# EAGLE schematic Esp_DVK (EAGLE 6.6.0)

## Sheet 1 of 9
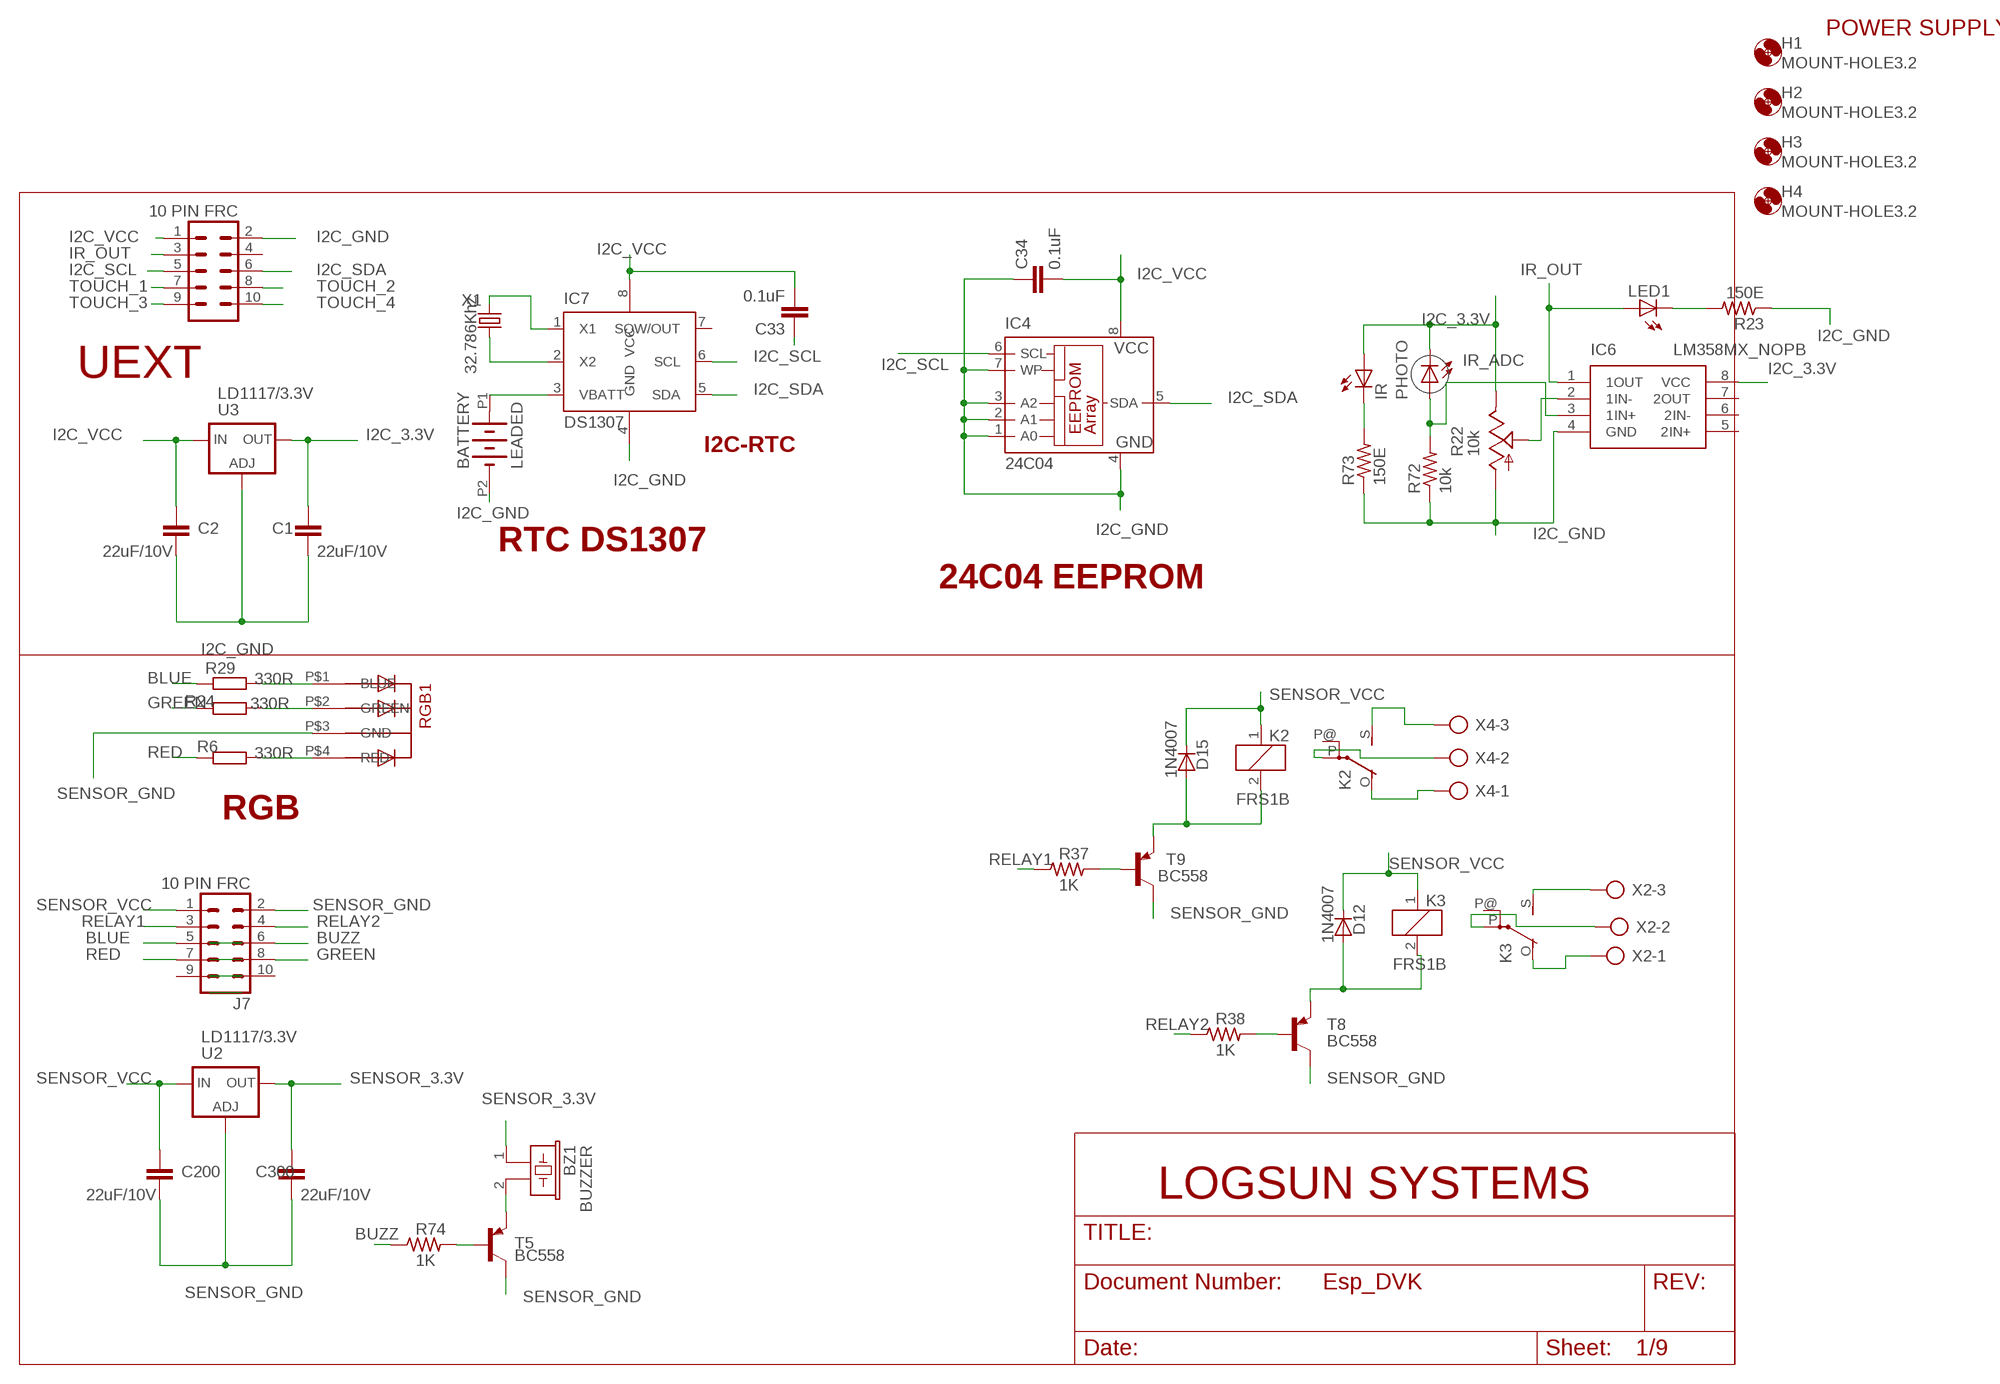
[diagram p0: schematic, sheet 1]

### Parts
BATTERY  LEADED  [LEADED]
BZ1  BUZZER  BUZZ  [BUZZ]
C1  22uF/10V  C-EUC1206  [C1206]
C2  22uF/10V  C-EUC1206  [C1206]
C33  0.1uF  C-EUC1206  [C1206]
C34  0.1uF  C-EUC1206  [C1206]
C200  22uF/10V  C-EUC1206  [C1206]
C300  22uF/10V  C-EUC1206  [C1206]
D12  1N4007  1N4004DIODE  [MLL34]
D15  1N4007  1N4004DIODE  [MLL34]
H1  MOUNT-HOLE3.2  [3,2]
H2  MOUNT-HOLE3.2  [3,2]
H3  MOUNT-HOLE3.2  [3,2]
H4  MOUNT-HOLE3.2  [3,2]
IC4  24C04  24C04ASM  [SO-08M]
IC6  LM358MX_NOPB  [SOIC127P600X175-8N]
IC7  DS1307  [SO08]
IR  LED5MM  [LED5MM]
J3  10 PIN FRC  ML10  [ML10]
J7  10 PIN FRC  ML10  [ML10]
K2  FRS1B  [FRS1B]
K3  FRS1B  [FRS1B]
LED1  LEDCHIPLED_1206  [CHIPLED_1206]
PHOTO  LED5MM  [LED5MM]
R6  330R  R-EU_R1206  [R1206]
R22  10k  TRIM_US-RJ9W  [RJ9W]
R23  150E  R-US_R1206  [R1206]
R24  330R  R-EU_R1206  [R1206]
R29  330R  R-EU_R1206  [R1206]
R37  1K  R-US_R1206  [R1206@1]
R38  1K  R-US_R1206  [R1206@1]
R72  10k  R-US_R1206  [R1206]
R73  150E  R-US_R1206  [R1206]
R74  1K  R-US_R1206  [R1206@1]
RGB1  5MMRGBLED  [LED5MMRGB]
T5  BC558  -PNP-SOT23-EBC  [SOT23-EBC]
T8  BC558  -PNP-SOT23-EBC  [SOT23-EBC]
T9  BC558  -PNP-SOT23-EBC  [SOT23-EBC]
U2  LD1117/3.3V  LD117AS12TR  [SOT223]
U3  LD1117/3.3V  LD117AS12TR  [SOT223]
X1  32.786Khz  CRYSTALTC38H  [TC38H]
X2  AK300/3  [AK300/3]
X4  AK300/3  [AK300/3]

### Nets
BLUE: J7.5 R29.1
BUZZ: J7.6 R74.1
GREEN: J7.8 R24.1
I2C_3.3V: C1.2 IC6.8(VCC) IR.A PHOTO.K(C) R22.E U3.4(OUT)
I2C_GND: BATTERY.P2(-) C1.1 C2.1 C33.1 C34.1 IC4.1(A0) IC4.2(A1) IC4.3(A2) IC4.4(GND) IC4.7(WP) IC6.4(GND) IC7.4(GND) J3.2 R22.A R23.1 R72.1 R73.1 U3.1(ADJ)
I2C_SCL: IC4.6(SCL) IC7.6(SCL) J3.5
I2C_SDA: IC4.5(SDA) IC7.5(SDA) J3.6
I2C_VCC: C2.2 C33.2 C34.2 IC4.8(VCC) IC7.8(VCC) J3.1 U3.3(IN)
IR_ADC: IC6.3(1IN+) PHOTO.A R72.2
IR_OUT: IC6.1(1OUT) J3.3 LED1.A
N$1: R24.2 RGB1.P$2(GREEN)
N$6: IC6.2(1IN-) R22.S
N$7: K3.S(2:S) X2.3
N$8: K2.S(2:S) X4.3
N$10: K2.P(2:P) X4.2
N$12: R29.2 RGB1.P$1(BLUE)
N$16: K2.O(2:O) X4.1
N$20: R38.2 T8.B
N$21: IR.K(C) R73.2
N$22: R6.2 RGB1.P$4(RED)
N$23: LED1.C R23.2
N$26: D12.A K3.2 T8.E
N$27: K3.P(2:P) X2.2
N$28: K3.O(2:O) X2.1
N$74: IC7.2(X2) X1.1
N$75: BATTERY.P1(+) IC7.3(VBATT)
N$76: IC7.1(X1) X1.2
N$112: R74.2 T5.B
N$113: BZ1.2 T5.E
N$120: R37.2 T9.B
N$121: D15.A K2.2 T9.E
RED: J7.7 R6.1
RELAY1: J7.3 R37.1
RELAY2: J7.4 R38.1
SENSOR_3.3V: BZ1.1 C300.2 U2.4(OUT)
SENSOR_GND: C200.1 C300.1 J7.2 RGB1.P$3(GND) T5.C T8.C T9.C U2.1(ADJ)
SENSOR_VCC: C200.2 D12.C D15.C J7.1 K2.1 K3.1 U2.3(IN)
TOUCH_1: J3.7
TOUCH_2: J3.8
TOUCH_3: J3.9
TOUCH_4: J3.10
Unconnected: IC6.5(2IN+) IC6.6(2IN-) IC6.7(2OUT) J3.4 J7.9 J7.10 K2.P@(2:P) K3.P@(2:P)

### Notes on the sheet
- POWER SUPPLY
- UEXT
- I2C-RTC
- RTC DS1307
- 24C04 EEPROM
- RGB

## Sheet 2 of 9
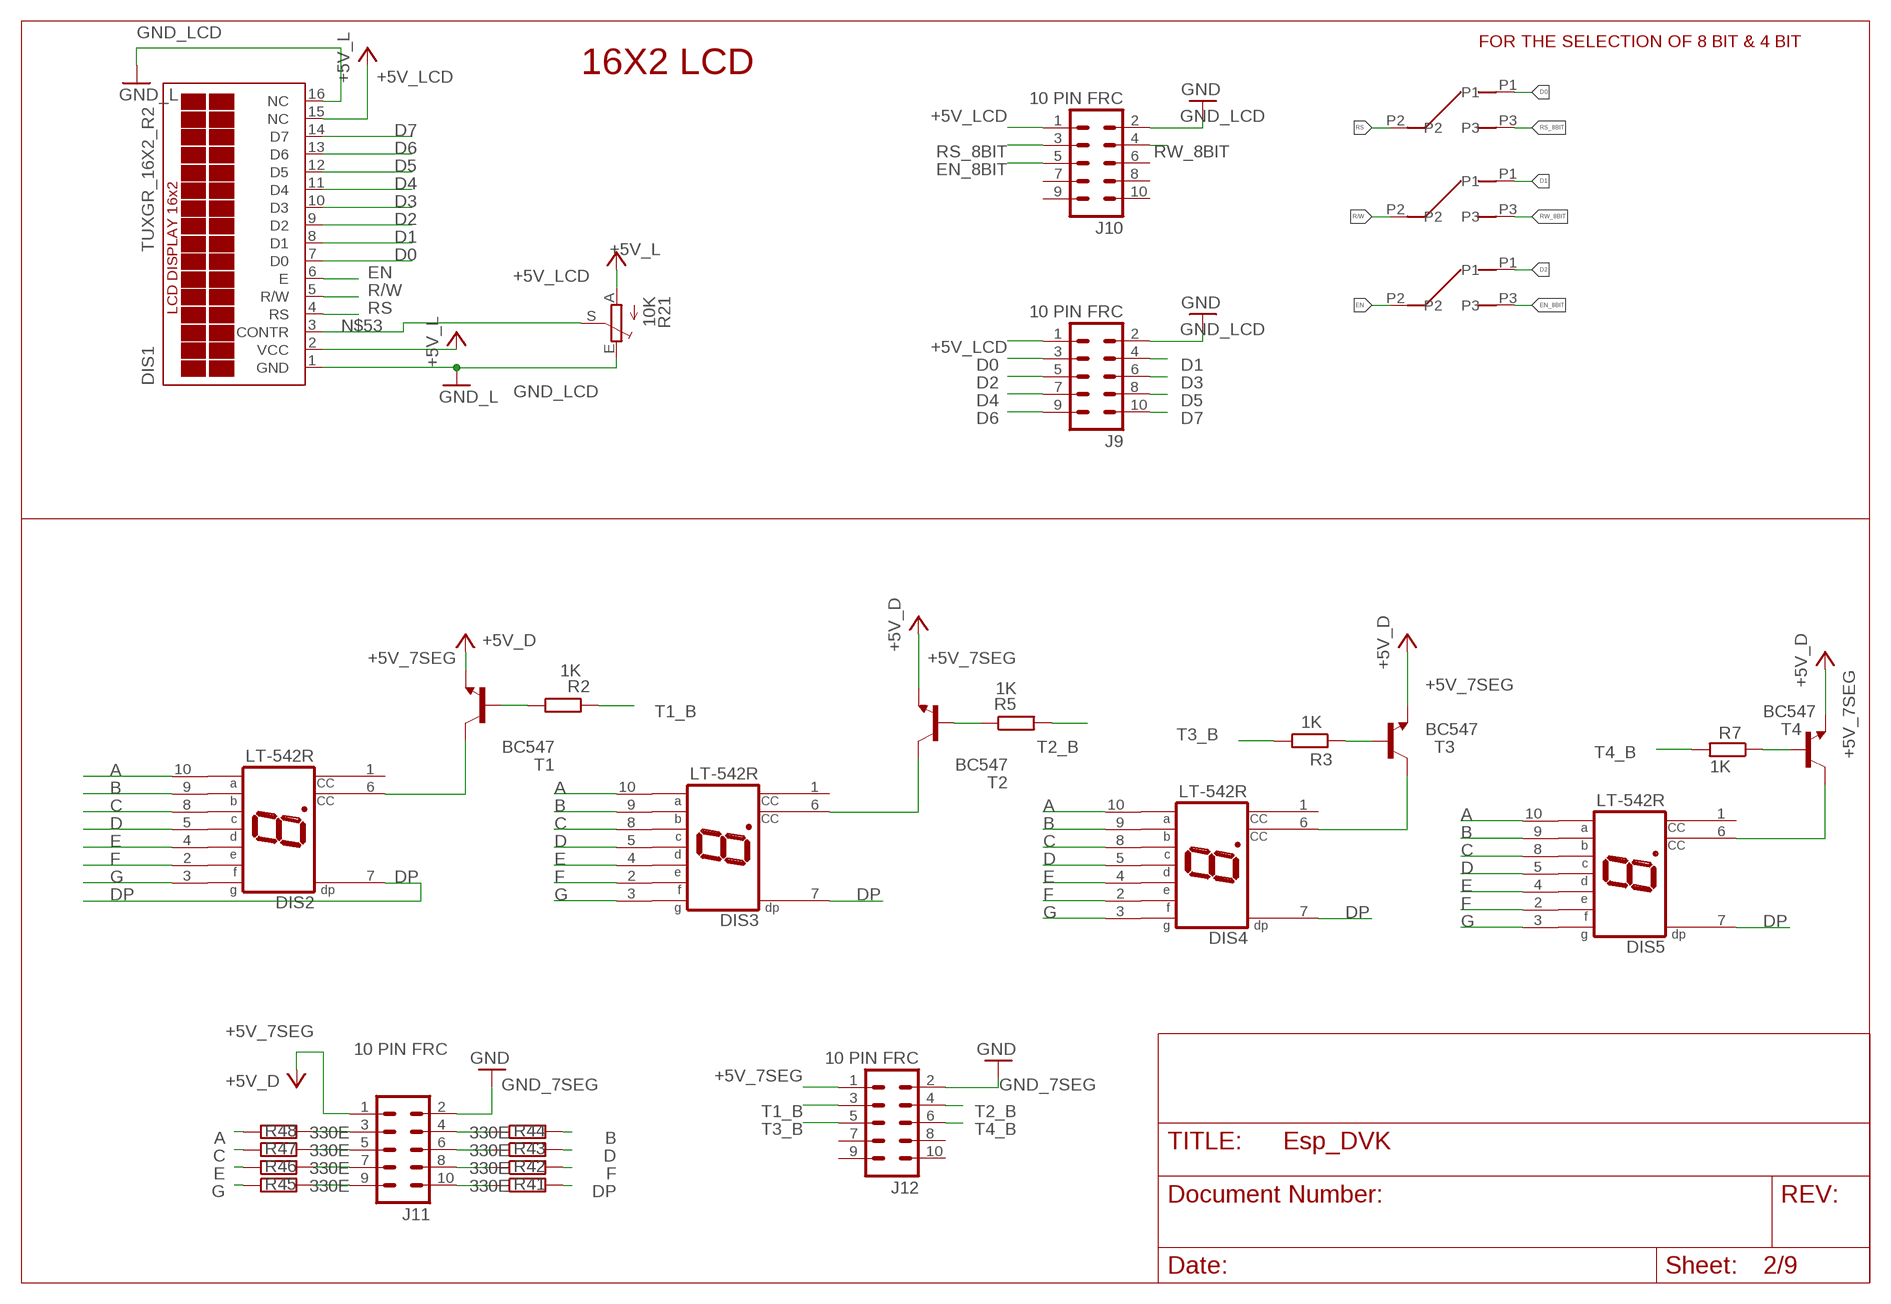
[diagram p1: schematic, sheet 2]

### Parts
DIS1  TUXGR_16X2_R2  [TUXGR_16X2_R2]
DIS2  LT-542R  HD-A103  [HDSP-A]
DIS3  LT-542R  HD-A103  [HDSP-A]
DIS4  LT-542R  HD-A103  [HDSP-A]
DIS5  LT-542R  HD-A103  [HDSP-A]
EN  SMALLSLIDESW  [SLIDESW]
J9  10 PIN FRC  ML10  [ML10]
J10  10 PIN FRC  ML10  [ML10]
J11  10 PIN FRC  ML10  [ML10]
J12  10 PIN FRC  ML10  [ML10]
R2  1K  R-EU_M1206  [M1206]
R3  1K  R-EU_M1206  [M1206]
R5  1K  R-EU_M1206  [M1206]
R7  1K  R-EU_M1206  [M1206]
R21  10K  TRIM_EU-RJ9W  [RJ9W]
R41  330E  R-EU_R1206  [R1206]
R42  330E  R-EU_R1206  [R1206]
R43  330E  R-EU_R1206  [R1206]
R44  330E  R-EU_R1206  [R1206]
R45  330E  R-EU_R1206  [R1206]
R46  330E  R-EU_R1206  [R1206]
R47  330E  R-EU_R1206  [R1206]
R48  330E  R-EU_R1206  [R1206]
R/W  SMALLSLIDESW  [SLIDESW]
RS  SMALLSLIDESW  [SLIDESW]
T1  BC547  -NPN-TO92  [TO92]
T2  BC547  -NPN-TO92  [TO92]
T3  BC547  -NPN-TO92  [TO92]
T4  BC547  -NPN-TO92  [TO92]

### Nets
+5V_7SEG: J11.1 J12.1 T1.1(E) T2.1(E) T3.1(E) T4.1(E) ; supply symbol labelled +5V_D
+5V_LCD: DIS1.2(VCC) DIS1.15(NC) J9.1 J10.1 R21.A ; supply symbol labelled +5V_L
A: DIS2.10(A) DIS3.10(A) DIS4.10(A) DIS5.10(A) R48.1
B: DIS2.9(B) DIS3.9(B) DIS4.9(B) DIS5.9(B) R44.2
C: DIS2.8(C) DIS3.8(C) DIS4.8(C) DIS5.8(C) R47.1
D: DIS2.5(D) DIS3.5(D) DIS4.5(D) DIS5.5(D) R43.2
D0: DIS1.7(D0) J9.3 RS.P1
D1: DIS1.8(D1) J9.4 R/W.P1
D2: DIS1.9(D2) EN.P1 J9.5
D3: DIS1.10(D3) J9.6
D4: DIS1.11(D4) J9.7
D5: DIS1.12(D5) J9.8
D6: DIS1.13(D6) J9.9
D7: DIS1.14(D7) J9.10
DP: DIS2.7(DP) DIS3.7(DP) DIS4.7(DP) DIS5.7(DP) R41.2
E: DIS2.4(E) DIS3.4(E) DIS4.4(E) DIS5.4(E) R46.1
EN: DIS1.6(E) EN.P2
EN_8BIT: EN.P3 J10.5
F: DIS2.2(F) DIS3.2(F) DIS4.2(F) DIS5.2(F) R42.2
G: DIS2.3(G) DIS3.3(G) DIS4.3(G) DIS5.3(G) R45.1
GND_7SEG: J11.2 J12.2 ; supply symbol labelled GND
GND_LCD: DIS1.1(GND) DIS1.16(NC) J9.2 J10.2 R21.E ; supply symbol labelled GND_L, GND
N$3: R3.1 T3.2(B)
N$5: R2.1 T1.2(B)
N$9: DIS2.6(CC) T1.3(C)
N$11: DIS4.6(CC) T3.3(C)
N$13: R5.1 T2.2(B)
N$14: DIS3.6(CC) T2.3(C)
N$15: R7.1 T4.2(B)
N$17: DIS5.6(CC) T4.3(C)
N$43: J11.4 R44.1
N$45: J11.6 R43.1
N$47: J11.8 R42.1
N$49: J11.10 R41.1
N$51: J11.3 R48.2
N$52: J11.5 R47.2
N$53: DIS1.3(CONTR) R21.S
N$55: J11.7 R46.2
N$59: J11.9 R45.2
R/W: DIS1.5(R/W) R/W.P2
RS: DIS1.4(RS) RS.P2
RS_8BIT: J10.3 RS.P3
RW_8BIT: J10.4 R/W.P3
T1_B: J12.3 R2.2
T2_B: J12.4 R5.2
T3_B: J12.5 R3.2
T4_B: J12.6 R7.2
Unconnected: DIS2.1(CC) DIS3.1(CC) DIS4.1(CC) DIS5.1(CC) J10.6 J10.7 J10.8 J10.9 J10.10 J12.7 J12.8 J12.9 J12.10

### Notes on the sheet
- FOR THE SELECTION OF 8 BIT & 4 BIT
- 16X2 LCD

## Sheet 3 of 9
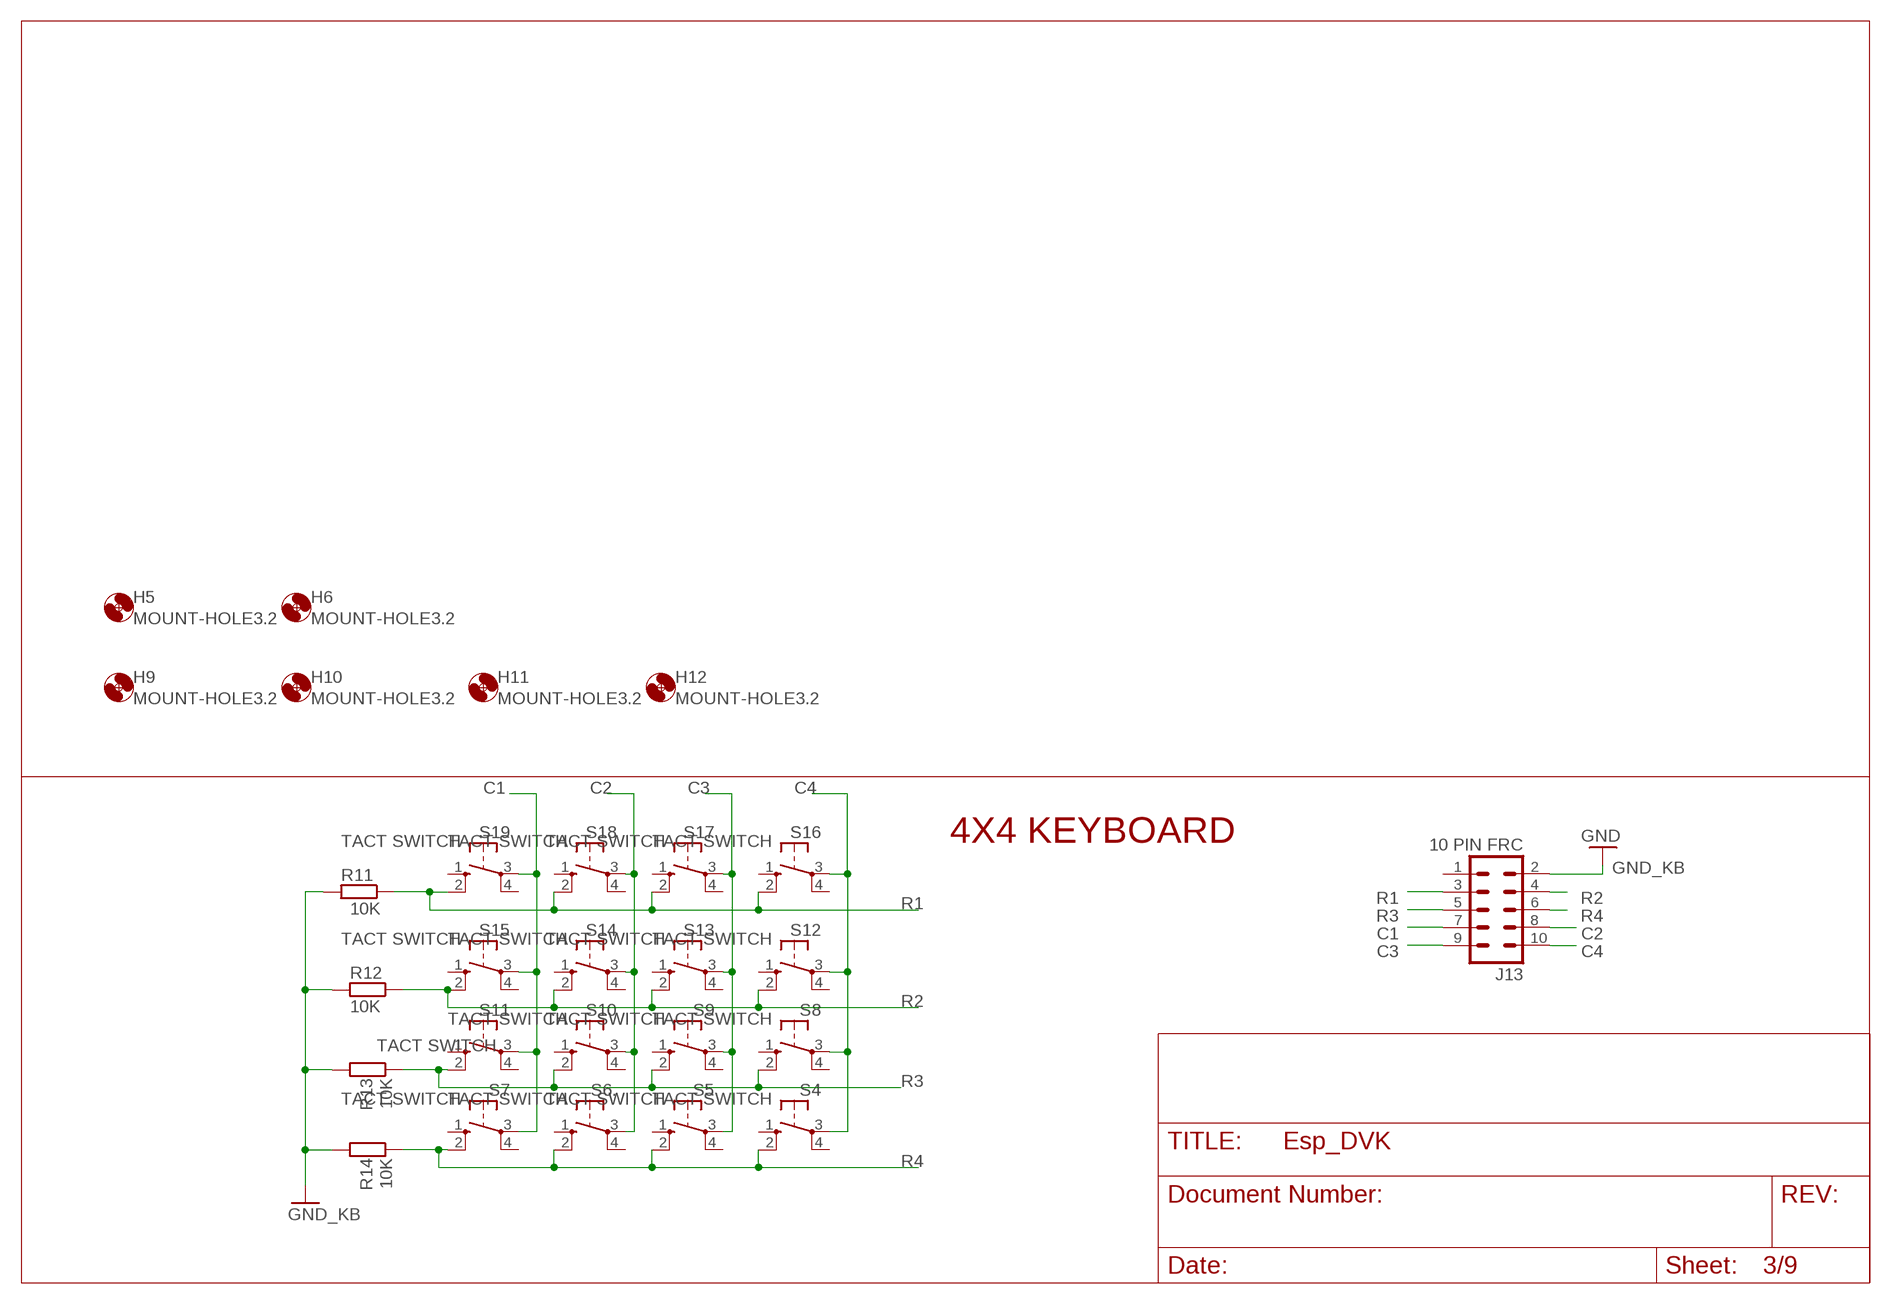
[diagram p2: schematic, sheet 3]

### Parts
H5  MOUNT-HOLE3.2  [3,2]
H6  MOUNT-HOLE3.2  [3,2]
H9  MOUNT-HOLE3.2  [3,2]
H10  MOUNT-HOLE3.2  [3,2]
H11  MOUNT-HOLE3.2  [3,2]
H12  MOUNT-HOLE3.2  [3,2]
J13  10 PIN FRC  ML10  [ML10]
R11  10K  R-EU_R1206  [R1206]
R12  10K  R-EU_R1206  [R1206]
R13  10K  R-EU_R1206  [R1206]
R14  10K  R-EU_R1206  [R1206]
S4  TACT SWITCH  10-XX  [B3F-10XX]
S5  TACT SWITCH  10-XX  [B3F-10XX]
S6.  TACT SWITCH  10-XX  [B3F-10XX]
S7  TACT SWITCH  10-XX  [B3F-10XX]
S8  TACT SWITCH  10-XX  [B3F-10XX]
S9  TACT SWITCH  10-XX  [B3F-10XX]
S10  TACT SWITCH  10-XX  [B3F-10XX]
S11  TACT SWITCH  10-XX  [B3F-10XX]
S12  TACT SWITCH  10-XX  [B3F-10XX]
S13  TACT SWITCH  10-XX  [B3F-10XX]
S14  TACT SWITCH  10-XX  [B3F-10XX]
S15  TACT SWITCH  10-XX  [B3F-10XX]
S16  TACT SWITCH  10-XX  [B3F-10XX]
S17  TACT SWITCH  10-XX  [B3F-10XX]
S18  TACT SWITCH  10-XX  [B3F-10XX]
S19  TACT SWITCH  10-XX  [B3F-10XX]

### Nets
C1: J13.7 S7.3(P) S11.3(P) S15.3(P) S19.3(P)
C2: J13.8 S6..3(P) S10.3(P) S14.3(P) S18.3(P)
C3: J13.9 S5.3(P) S9.3(P) S13.3(P) S17.3(P)
C4: J13.10 S4.3(P) S8.3(P) S12.3(P) S16.3(P)
GND_KB: J13.2 R11.2 R12.2 R13.2 R14.2 ; supply symbol labelled GND
R1: J13.3 R11.1 S16.2(S1) S17.2(S1) S18.2(S1) S19.2(S1)
R2: J13.4 R12.1 S12.2(S1) S13.2(S1) S14.2(S1) S15.2(S1)
R3: J13.5 R13.1 S8.2(S1) S9.2(S1) S10.2(S1) S11.2(S1)
R4: J13.6 R14.1 S4.2(S1) S5.2(S1) S6..2(S1) S7.2(S1)
Unconnected: J13.1 S4.1(S) S4.4(P1) S5.1(S) S5.4(P1) S6..1(S) S6..4(P1) S7.1(S) S7.4(P1) S8.1(S) S8.4(P1) S9.1(S) S9.4(P1) S10.1(S) S10.4(P1) S11.1(S) S11.4(P1) S12.1(S) S12.4(P1) S13.1(S) S13.4(P1) S14.1(S) S14.4(P1) S15.1(S) S15.4(P1) S16.1(S) S16.4(P1) S17.1(S) S17.4(P1) S18.1(S) S18.4(P1) S19.1(S) S19.4(P1)

### Notes on the sheet
- 4X4 KEYBOARD

## Sheet 4 of 9
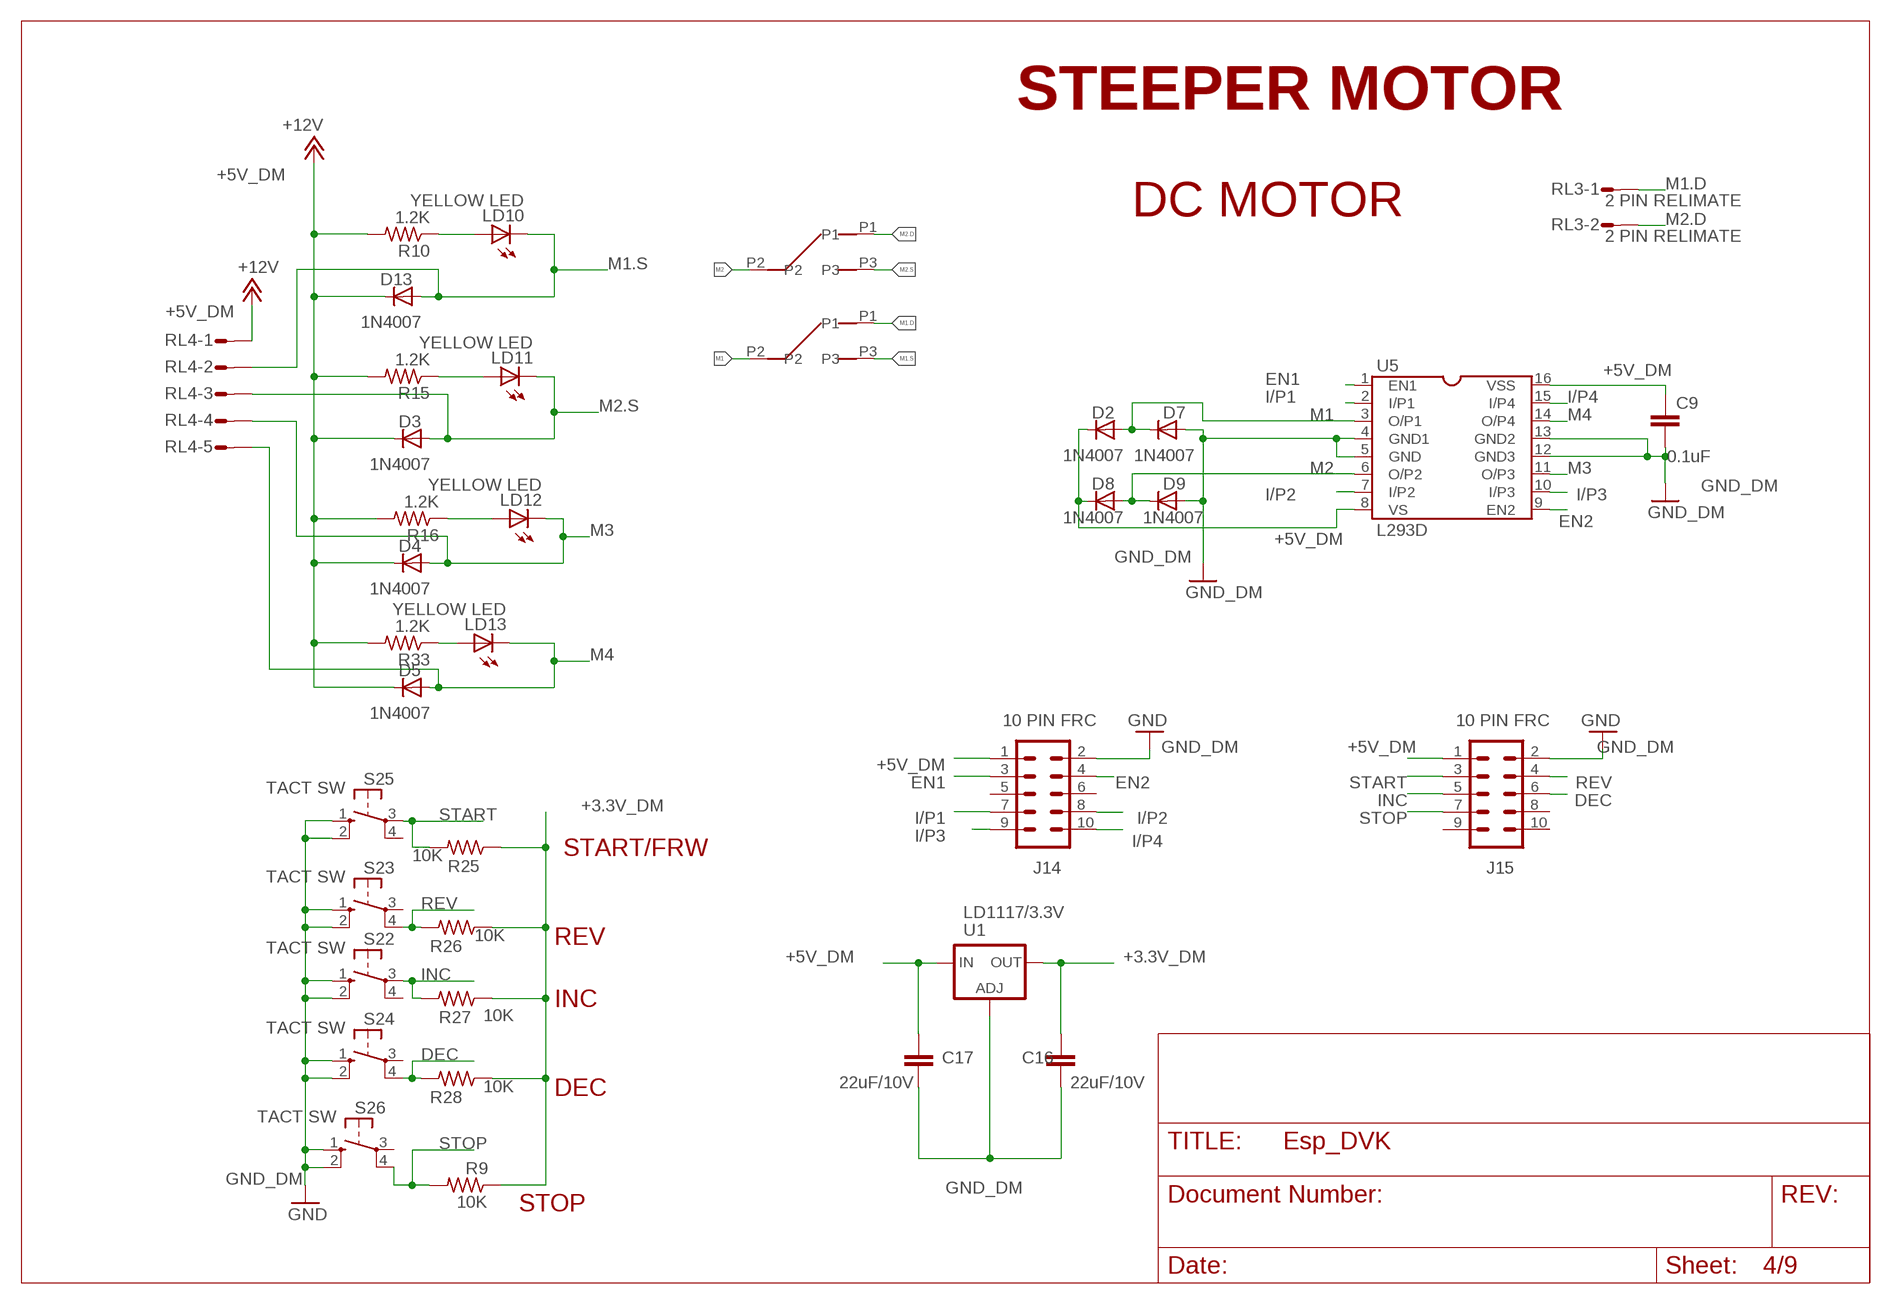
[diagram p3: schematic, sheet 4]

### Parts
C9  0.1uF  C-EUC1206  [C1206]
C16  22uF/10V  C-EUC1206  [C1206]
C17  22uF/10V  C-EUC1206  [C1206]
D2  1N4007  1N4004DIODE  [MLL34]
D3  1N4007  1N4004DIODE  [MLL34]
D4  1N4007  1N4004DIODE  [MLL34]
D5  1N4007  1N4004DIODE  [MLL34]
D7  1N4007  1N4004DIODE  [MLL34]
D8  1N4007  1N4004DIODE  [MLL34]
D9  1N4007  1N4004DIODE  [MLL34]
D13  1N4007  1N4004DIODE  [MLL34]
J14  10 PIN FRC  ML10  [ML10]
J15  10 PIN FRC  ML10  [ML10]
LD10  YELLOW LED  LEDCHIPLED_1206  [CHIPLED_1206]
LD11  YELLOW LED  LEDCHIPLED_1206  [CHIPLED_1206]
LD12  YELLOW LED  LEDCHIPLED_1206  [CHIPLED_1206]
LD13  YELLOW LED  LEDCHIPLED_1206  [CHIPLED_1206]
R9  10K  R-US_R1206  [R1206@1]
R10  1.2K  R-US_R1206  [R1206@1]
R15  1.2K  R-US_R1206  [R1206@1]
R16  1.2K  R-US_R1206  [R1206@1]
R25  10K  R-US_R1206  [R1206@1]
R26  10K  R-US_R1206  [R1206@1]
R27  10K  R-US_R1206  [R1206@1]
R28  10K  R-US_R1206  [R1206@1]
R33  1.2K  R-US_R1206  [R1206@1]
RL3  2 PIN RELIMATE  S02P  [S02P]
RL4  S05P  [S05P]
S22  TACT SW  10-XX  [B3F-10XX]
S23  TACT SW  10-XX  [B3F-10XX]
S24  TACT SW  10-XX  [B3F-10XX]
S25  TACT SW  10-XX  [B3F-10XX]
S26  TACT SW  10-XX  [B3F-10XX]
S_14  SMALLSLIDESW  [SLIDESW]
S_15  SMALLSLIDESW  [SLIDESW]
U1  LD1117/3.3V  LD117AS12TR  [SOT223]
U5  L293D  L293DS  [SOCKET-16]

### Nets
+3.3V_DM: C16.2 R9.1 R25.1 R26.1 R27.1 R28.1 U1.4(OUT)
+5V_DM: C9.2 C17.2 D2.C D3.C D4.C D5.C D8.C D13.C J14.1 J15.1 R10.2 R15.2 R16.2 R33.2 RL4.1 U1.3(IN) U5.8(VS) U5.16(VSS) ; supply symbol labelled +12V
DEC: J15.6 R28.2 S24.4(P1)
EN1: J14.3 U5.1(EN1)
EN2: J14.4 U5.9(EN2)
GND_DM: C9.1 C16.1 C17.1 D7.A D9.A J14.2 J15.2 S22.1(S) S22.2(S1) S23.1(S) S23.2(S1) S24.1(S) S24.2(S1) S25.1(S) S25.2(S1) S26.1(S) S26.2(S1) U1.1(ADJ) U5.4(GND1) U5.5(GND) U5.12(GND3) U5.13(GND2) ; supply symbol labelled GND
I/P1: J14.7 U5.2(I/P1)
I/P2: J14.8 U5.7(I/P2)
I/P3: J14.9 U5.10(I/P3)
I/P4: J14.10 U5.15(I/P4)
INC: J15.5 R27.2 S22.3(P)
M1: D2.A D7.C S_15.P2 U5.3(O/P1)
M1.D: RL3.1 S_15.P1
M1.S: D13.A LD10.C RL4.2 S_15.P3
M2: D8.A D9.C S_14.P2 U5.6(O/P2)
M2.D: RL3.2 S_14.P1
M2.S: D3.A LD11.C RL4.3 S_14.P3
M3: D4.A LD12.C RL4.4 U5.11(O/P3)
M4: D5.A LD13.C RL4.5 U5.14(O/P4)
N$18: LD10.A R10.1
N$19: LD11.A R15.1
N$48: LD12.A R16.1
N$50: LD13.A R33.1
REV: J15.4 R26.2 S23.4(P1)
START: J15.3 R25.2 S25.3(P)
STOP: J15.7 R9.2 S26.4(P1)
Unconnected: J14.5 J14.6 J15.8 J15.9 J15.10 S22.4(P1) S23.3(P) S24.3(P) S25.4(P1) S26.3(P)

### Notes on the sheet
- STEEPER MOTOR
- DC MOTOR
- START/FRW
- REV
- INC
- DEC
- STOP

## Sheet 5 of 9
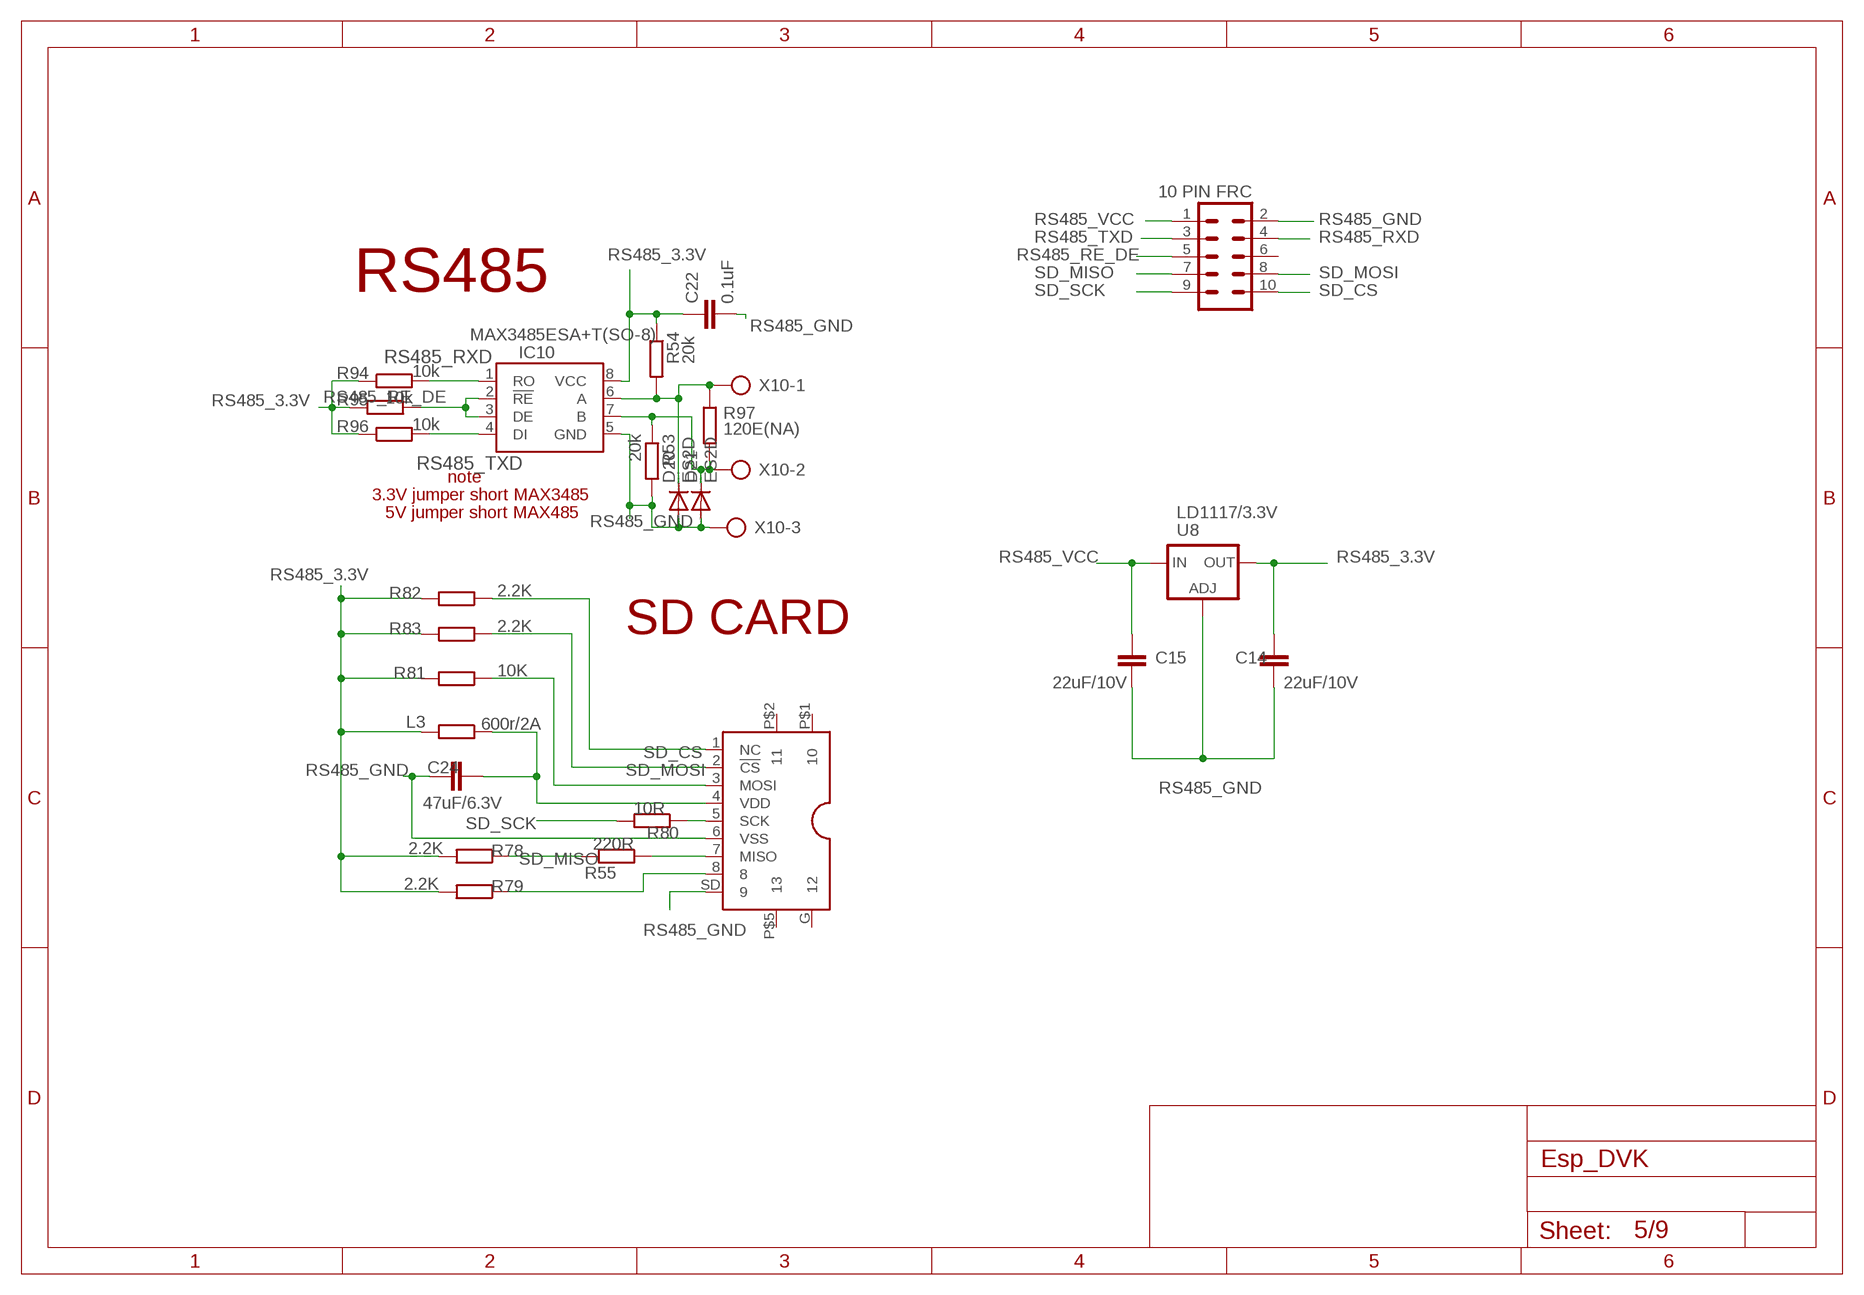
[diagram p4: schematic, sheet 5]

### Parts
C14  22uF/10V  C-EUC1206  [C1206]
C15  22uF/10V  C-EUC1206  [C1206]
C22  0.1uF  C-EUC0805  [C0805]
C24  47uF/6.3V  C-EUC1206  [C1206]
D20  ES2D  [SMB]
D21  ES2D  [SMB]
IC10  MAX3485ESA+T(SO-8)  LTC485S  [SOIC8]
J5  10 PIN FRC  ML10  [ML10]
L3  600r/2A  R-EU_R1206  [R1206]
R53  20k  R-EU_R1206  [R1206]
R54  20k  R-EU_R1206  [R1206]
R55  220R  R-EU_R1206  [R1206]
R78  2.2K  R-EU_R1206  [R1206]
R79  2.2K  R-EU_R1206  [R1206]
R80  10R  R-EU_R1206  [R1206]
R81  10K  R-EU_R1206  [R1206]
R82  2.2K  R-EU_R1206  [R1206]
R83  2.2K  R-EU_R1206  [R1206]
R94  10k  R-EU_R1206  [R1206]
R95  10k  R-EU_R1206  [R1206]
R96  10k  R-EU_R1206  [R1206]
R97  120E(NA)  R-EU_R1206  [R1206]
U8  LD1117/3.3V  LD117AS12TR  [SOT223]
X5  SDCARD-TF07  [SDCARD]
X10  AK300/3  [AK300/3]

### Nets
N$35: D21.C IC10.7(B) R53.1 R97.2 X10.2
N$38: D20.C IC10.6(A) R54.2 R97.1 X10.1
N$39: R82.1 X5.1(NC)
N$56: C24.2 L3.1 X5.4(VDD)
N$57: R80.1 X5.5(SCK)
N$61: R55.1 X5.7(MISO)
N$63: R79.1 X5.8
RS485_3.3V: C14.2 C22.1 IC10.8(VCC) L3.2 R54.1 R78.2 R79.2 R81.2 R82.2 R83.2 R94.1 R95.1 R96.1 U8.4(OUT)
RS485_GND: C14.1 C15.1 C22.2 C24.1 D20.A D21.A IC10.5(GND) J5.2 R53.2 U8.1(ADJ) X5.6(VSS) X5.SD X10.3
RS485_RE_DE: IC10.2(!RE) IC10.3(DE) J5.5 R95.2
RS485_RXD: IC10.1(RO) J5.4 R94.2
RS485_TXD: IC10.4(DI) J5.3 R96.2
RS485_VCC: C15.2 J5.1 U8.3(IN)
SD_CS: J5.10 R83.1 X5.2(!CS)
SD_MISO: J5.7 R55.2 R78.1
SD_MOSI: J5.8 R81.1 X5.3(MOSI)
SD_SCK: J5.9 R80.2
Unconnected: J5.6 X5.G X5.P$1 X5.P$2 X5.P$5

### Notes on the sheet
- RS485
- note
- 3.3V jumper short MAX3485
- 5V jumper short MAX485
- SD CARD

## Sheet 6 of 9
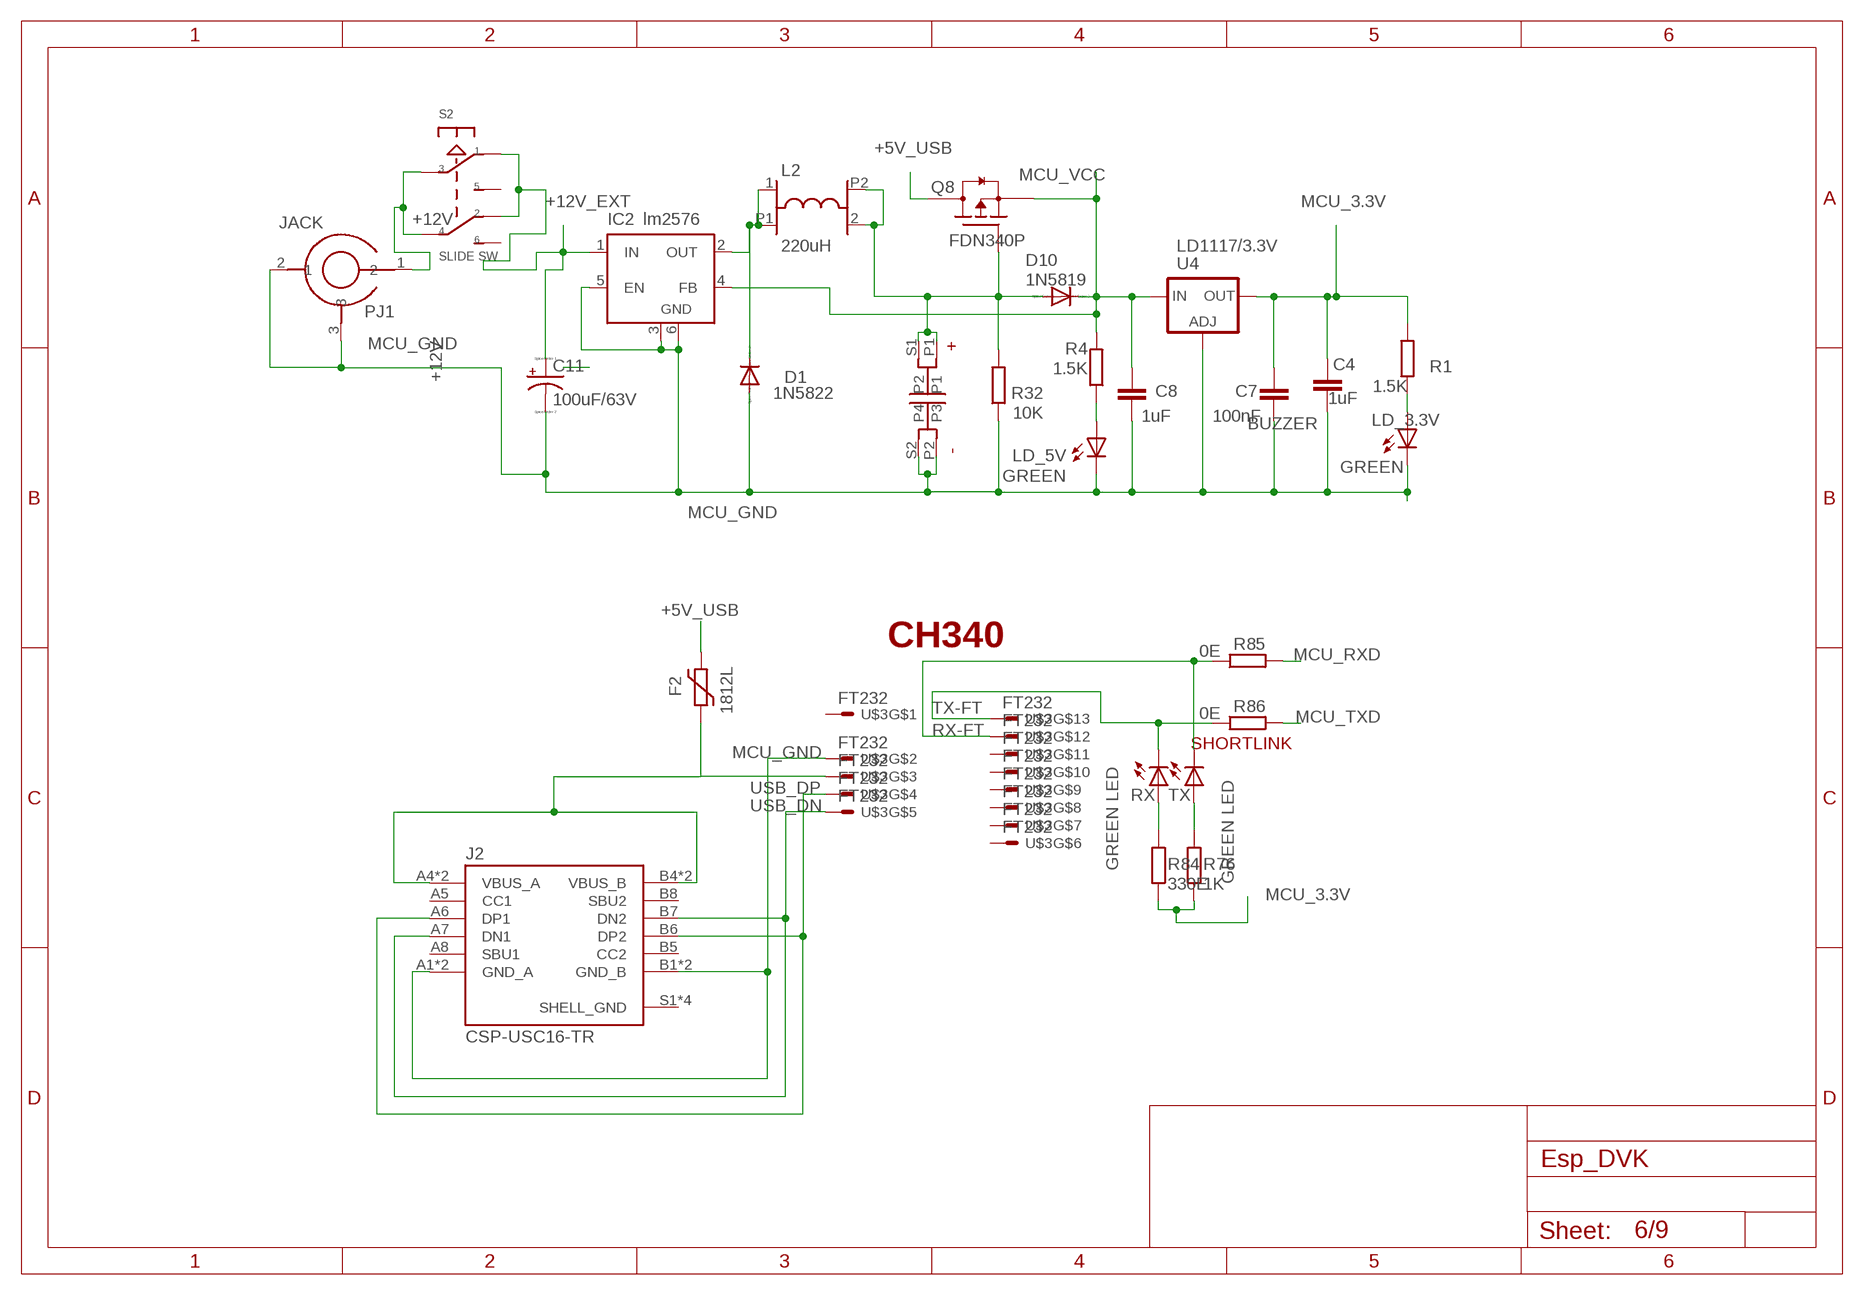
[diagram p5: schematic, sheet 6]

### Parts
C4  1uF  C-EUC1206  [C1206]
C7  100nF  C-EUC1206  [C1206]
C8  1uF  C-EUC1206  [C1206]
C11  100uF/63V  CPOL-USE3.5-10  [E3,5-10]
C21  1000uF/63V  SMD&DIP  [140CLH-1010]
D1  1N5822  1N5624  [DO201-15]
D10  1N5819  1N4004  [DO41-10]
F2  1812L  [1812L]
IC2  lm2576  LM2596S  [TO263-5]
J2  CSP-USC16-TR  [VALCON_CSP-USC16-TR]
L2  220uH  DIL4  [MS42]
LD_3.3V  GREEN  LED3MM  [LED3MM]
LD_5V  GREEN  LED3MM  [LED3MM]
PJ1  JACK  [JACK]
Q8  FDN340P  MOSFET-PCH_SOT-23  [SOT95P280X135-3N]
R1  1.5K  R-EU_R1206  [R1206]
R4  1.5K  R-EU_R1206  [R1206]
R32  10K  R-EU_R1206  [R1206]
R76  1K  R-EU_R1206  [R1206]
R84  330E  R-EU_R1206  [R1206]
R85  0E  R-EU_R1206  [R1206]
R86  0E  R-EU_R1206  [R1206]
RX  GREEN LED  LEDCHIPLED_1206  [CHIPLED_1206]
S2  SLIDE SW  SW  [SLIDE]
TX  GREEN LED  LEDCHIPLED_1206  [CHIPLED_1206]
U4  LD1117/3.3V  LD117AS12TR  [SOT223]
U$3  FT232  [FT232]

### Nets
+5V_USB: F2.P$2 Q8.3(D)
+12V: PJ1.1 S2.3 S2.4
+12V_EXT: C11.+ IC2.1(IN) S2.1 S2.2
MCU_3.3V: C4.2 C7.2 R1.2 R76.1 R84.1 U4.4(OUT) ; also sheet 9
MCU_GND: C4.1 C7.1 C8.1 C11.- C21.P2(P3) C21.S2(P4) D1.A IC2.3(GND) IC2.5(EN) IC2.6(GND) J2.A1(GND_A) J2.A12(GND_A) J2.B1(GND_B) J2.B12(GND_B) LD_3.3V.K(C) LD_5V.K(C) PJ1.2 PJ1.3 R32.1 U4.1(ADJ) U$3.2 ; also sheet 9
MCU_RXD: R85.2 ; also sheet 9
MCU_TXD: R86.2 ; also sheet 9
MCU_VCC: C8.2 D10.C IC2.4(FB) Q8.2(S) R4.2 U4.3(IN) ; also sheet 9
N$2: D1.C IC2.2(OUT) L2.1 L2.P1
N$58: F2.P$1 J2.A4(VBUS_A) J2.A9(VBUS_A) J2.B4(VBUS_B) J2.B9(VBUS_B) U$3.3
N$93: LD_5V.A R4.1
N$94: C21.P1 C21.S1(P2) D10.A L2.2 L2.P2 Q8.1(G) R32.2
N$101: LD_3.3V.A R1.1
N$119: R76.2 TX.A
N$122: R84.2 RX.A
RX-FT: R85.1 TX.C U$3.12
TX-FT: R86.1 RX.C U$3.13
USB_DN: J2.A7(DN1) J2.B7(DN2) U$3.5
USB_DP: J2.A6(DP1) J2.B6(DP2) U$3.4
Unconnected: J2.A5(CC1) J2.A8(SBU1) J2.B5(CC2) J2.B8(SBU2) S2.5 S2.6 U$3.1 U$3.6 U$3.7 U$3.8 U$3.9 U$3.10 U$3.11

### Notes on the sheet
- BUZZER
- CH340
- SHORTLINK

## Sheet 7 of 9
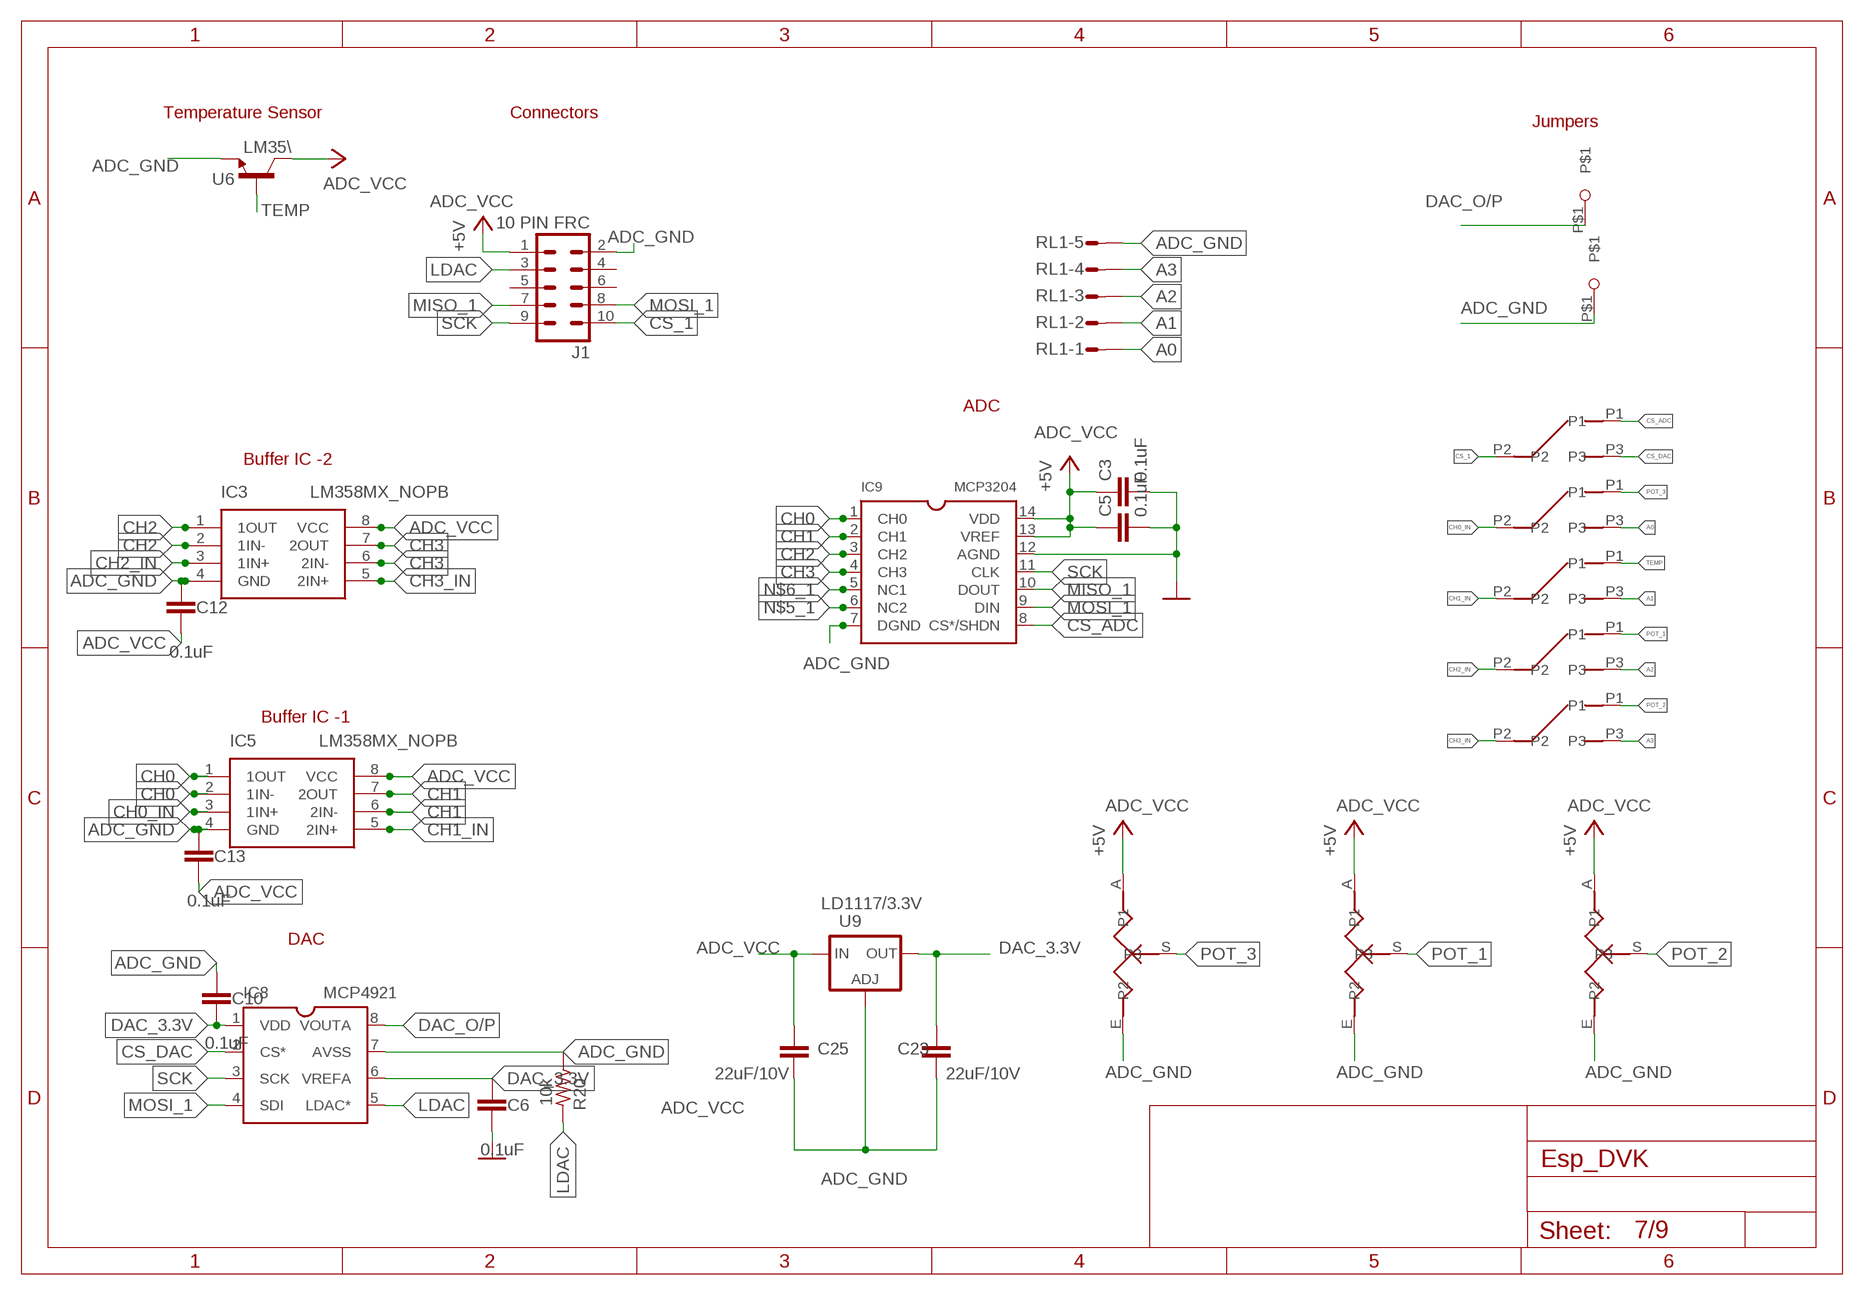
[diagram p6: schematic, sheet 7]

### Parts
C3  0.1uF  C-EUC1206  [C1206]
C5  0.1uF  C-EUC1206  [C1206]
C6  0.1uF  C-EUC1206  [C1206]
C10  0.1uF  C-EUC1206  [C1206]
C12  0.1uF  C-EUC1206  [C1206]
C13  0.1uF  C-EUC1206  [C1206]
C23  22uF/10V  C-EUC1206  [C1206]
C25  22uF/10V  C-EUC1206  [C1206]
DACO/P  TEST_PAD  [3.2MM]
GND  TEST_PAD  [3.2MM]
IC3  LM358MX_NOPB  [SOIC127P600X175-8N]
IC5  LM358MX_NOPB  [SOIC127P600X175-8N]
IC8  MCP4921  [SOIC-8N]
IC9  MCP3204  [SOIC-14N]
J1  10 PIN FRC  ML10  [ML10]
POT1  10K  ACP  [CA6V]
POT2  10K  ACP  [CA6V]
POT3  10K  ACP  [CA6V]
R20  10k  R-US_R1206  [R1206@1]
RL1  S05P  [S05P]
S_9  SMALLSLIDESW  [SLIDESW]
S_10  SMALLSLIDESW  [SLIDESW]
S_11  SMALLSLIDESW  [SLIDESW]
S_12  SMALLSLIDESW  [SLIDESW]
S_13  SMALLSLIDESW  [SLIDESW]
U6  LM35\  BC547  [TO92]
U9  LD1117/3.3V  LD117AS12TR  [SOT223]

### Nets
A0: RL1.1 S_10.P3
A1: RL1.2 S_11.P3
A2: RL1.3 S_12.P3
A3: RL1.4 S_13.P3
ADC_GND: C10.1 C12.1 C13.1 C23.1 C25.1 GND.P$1 IC3.4(GND) IC5.4(GND) IC8.7(AVSS) IC9.7(DGND) J1.2 POT1.E(P2) POT2.E(P2) POT3.E(P2) R20.1 RL1.5 U6.1(E) U9.1(ADJ)
ADC_VCC: C3.1 C5.1 C12.2 C13.2 C25.2 IC3.8(VCC) IC5.8(VCC) IC9.13(VREF) IC9.14(VDD) J1.1 POT1.A(P1) POT2.A(P1) POT3.A(P1) U6.3(C) U9.3(IN) ; supply symbol labelled +5V, VCC
CH0: IC5.1(1OUT) IC5.2(1IN-) IC9.1(CH0)
CH0_IN: IC5.3(1IN+) S_10.P2
CH1: IC5.6(2IN-) IC5.7(2OUT) IC9.2(CH1)
CH1_IN: IC5.5(2IN+) S_11.P2
CH2: IC3.1(1OUT) IC3.2(1IN-) IC9.3(CH2)
CH2_IN: IC3.3(1IN+) S_12.P2
CH3: IC3.6(2IN-) IC3.7(2OUT) IC9.4(CH3)
CH3_IN: IC3.5(2IN+) S_13.P2
CS_1: J1.10 S_9.P2
CS_ADC: IC9.8(CS*/SHDN) S_9.P1
CS_DAC: IC8.2(CS*) S_9.P3
DAC_3.3V: C6.1 C10.2 C23.2 IC8.1(VDD) IC8.6(VREFA) U9.4(OUT)
DAC_O/P: DACO/P.P$1 IC8.8(VOUTA)
GND_ADC: C3.2 C5.2 C6.2 IC9.12(AGND) ; supply symbol labelled GND_L
LDAC: IC8.5(LDAC*) J1.3 R20.2
MISO_1: IC9.10(DOUT) J1.7
MOSI_1: IC8.4(SDI) IC9.9(DIN) J1.8
N$5_1: IC9.6(NC2)
N$6_1: IC9.5(NC1)
POT_1: POT3.S(P3) S_12.P1
POT_2: POT2.S(P3) S_13.P1
POT_3: POT1.S(P3) S_10.P1
SCK: IC8.3(SCK) IC9.11(CLK) J1.9
TEMP: S_11.P1 U6.2(B)
Unconnected: J1.4 J1.5 J1.6

### Notes on the sheet
- Temperature Sensor | Connectors
- Jumpers
- ADC
- Buffer IC -2
- Buffer IC -1
- DAC

## Sheet 8 of 9
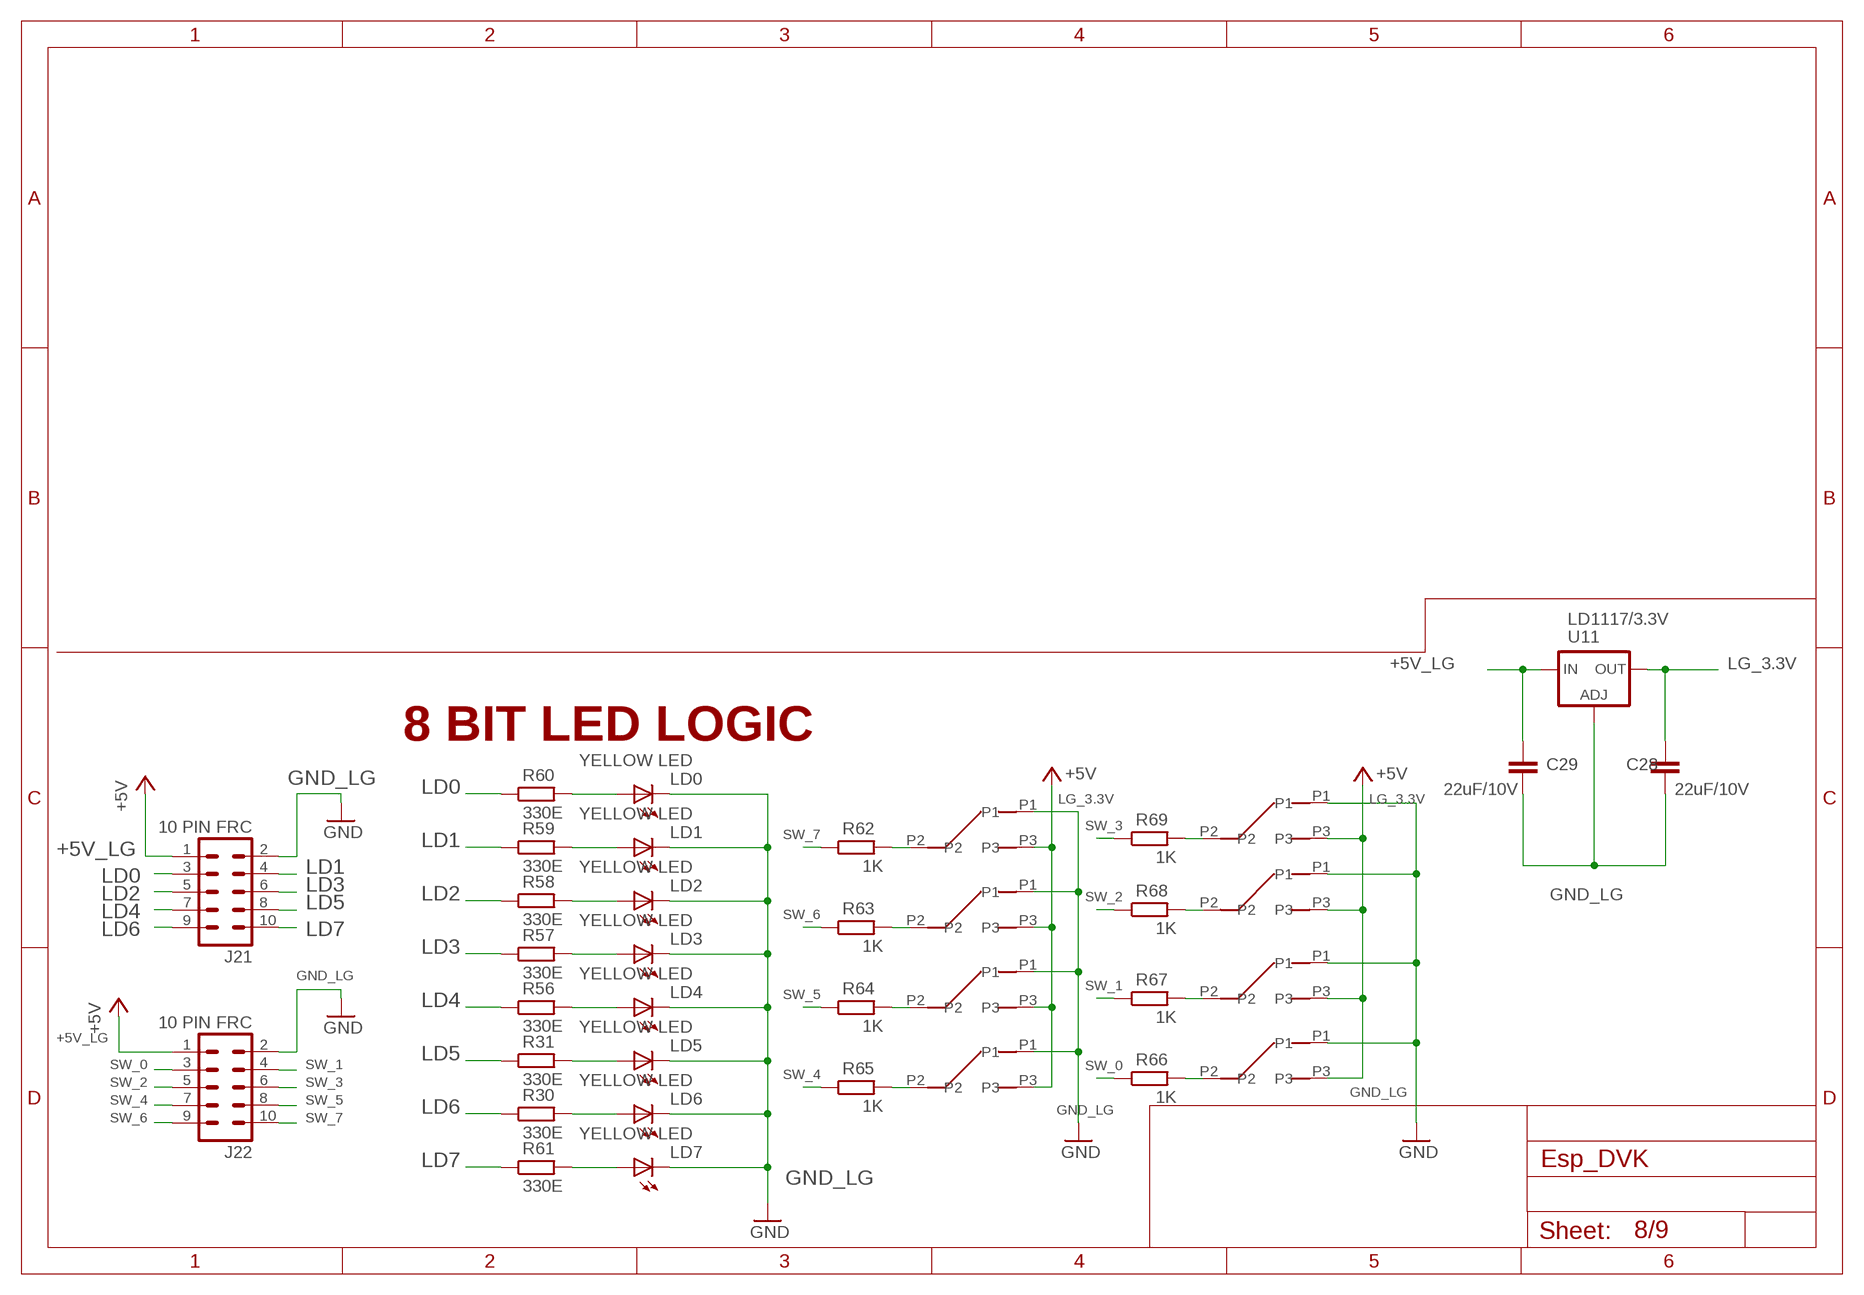
[diagram p7: schematic, sheet 8]

### Parts
C28  22uF/10V  C-EUC1206  [C1206]
C29  22uF/10V  C-EUC1206  [C1206]
J21  10 PIN FRC  ML10  [ML10]
J22  10 PIN FRC  ML10  [ML10]
L4  YELLOW LED  LEDCHIPLED_1206  [CHIPLED_1206]
L5  YELLOW LED  LEDCHIPLED_1206  [CHIPLED_1206]
L6  YELLOW LED  LEDCHIPLED_1206  [CHIPLED_1206]
L7  YELLOW LED  LEDCHIPLED_1206  [CHIPLED_1206]
L8  YELLOW LED  LEDCHIPLED_1206  [CHIPLED_1206]
L9  YELLOW LED  LEDCHIPLED_1206  [CHIPLED_1206]
L10  YELLOW LED  LEDCHIPLED_1206  [CHIPLED_1206]
L11  YELLOW LED  LEDCHIPLED_1206  [CHIPLED_1206]
R30  330E  R-EU_R1206  [R1206]
R31  330E  R-EU_R1206  [R1206]
R56  330E  R-EU_R1206  [R1206]
R57  330E  R-EU_R1206  [R1206]
R58  330E  R-EU_R1206  [R1206]
R59  330E  R-EU_R1206  [R1206]
R60  330E  R-EU_R1206  [R1206]
R61  330E  R-EU_R1206  [R1206]
R62  1K  R-EU_R1206  [R1206]
R63  1K  R-EU_R1206  [R1206]
R64  1K  R-EU_R1206  [R1206]
R65  1K  R-EU_R1206  [R1206]
R66  1K  R-EU_R1206  [R1206]
R67  1K  R-EU_R1206  [R1206]
R68  1K  R-EU_R1206  [R1206]
R69  1K  R-EU_R1206  [R1206]
S_1  SMALLSLIDESW  [SLIDESW]
S_2  SMALLSLIDESW  [SLIDESW]
S_3  SMALLSLIDESW  [SLIDESW]
S_4  SMALLSLIDESW  [SLIDESW]
S_5  SMALLSLIDESW  [SLIDESW]
S_6  SMALLSLIDESW  [SLIDESW]
S_7  SMALLSLIDESW  [SLIDESW]
S_8  SMALLSLIDESW  [SLIDESW]
U11  LD1117/3.3V  LD117AS12TR  [SOT223]

### Nets
+5V_LG: C29.2 J21.1 J22.1 U11.3(IN) ; supply symbol labelled +5V
GND_LG: C28.1 C29.1 J21.2 J22.2 L4.C L5.C L6.C L7.C L8.C L9.C L10.C L11.C S_1.P1 S_2.P1 S_3.P1 S_4.P1 S_5.P1 S_6.P1 S_7.P1 S_8.P1 U11.1(ADJ) ; supply symbol labelled GND
LD0: J21.3 R60.1
LD1: J21.4 R59.1
LD2: J21.5 R58.1
LD3: J21.6 R57.1
LD4: J21.7 R56.1
LD5: J21.8 R31.1
LD6: J21.9 R30.1
LD7: J21.10 R61.1
LG_3.3V: C28.2 S_1.P3 S_2.P3 S_3.P3 S_4.P3 S_5.P3 S_6.P3 S_7.P3 S_8.P3 U11.4(OUT) ; supply symbol labelled +5V
N$42: L4.A R60.2
N$54: L5.A R59.2
N$73: R62.2 S_8.P2
N$77: L6.A R58.2
N$88: L7.A R57.2
N$90: L8.A R56.2
N$91: L9.A R31.2
N$92: L10.A R30.2
N$96: L11.A R61.2
N$98: R63.2 S_7.P2
N$99: R64.2 S_6.P2
N$102: R65.2 S_5.P2
N$103: R69.2 S_4.P2
N$104: R68.2 S_3.P2
N$105: R67.2 S_2.P2
N$106: R66.2 S_1.P2
SW_0: J22.3 R66.1
SW_1: J22.4 R67.1
SW_2: J22.5 R68.1
SW_3: J22.6 R69.1
SW_4: J22.7 R65.1
SW_5: J22.8 R64.1
SW_6: J22.9 R63.1
SW_7: J22.10 R62.1

### Notes on the sheet
- 8 BIT LED LOGIC

## Sheet 9 of 9
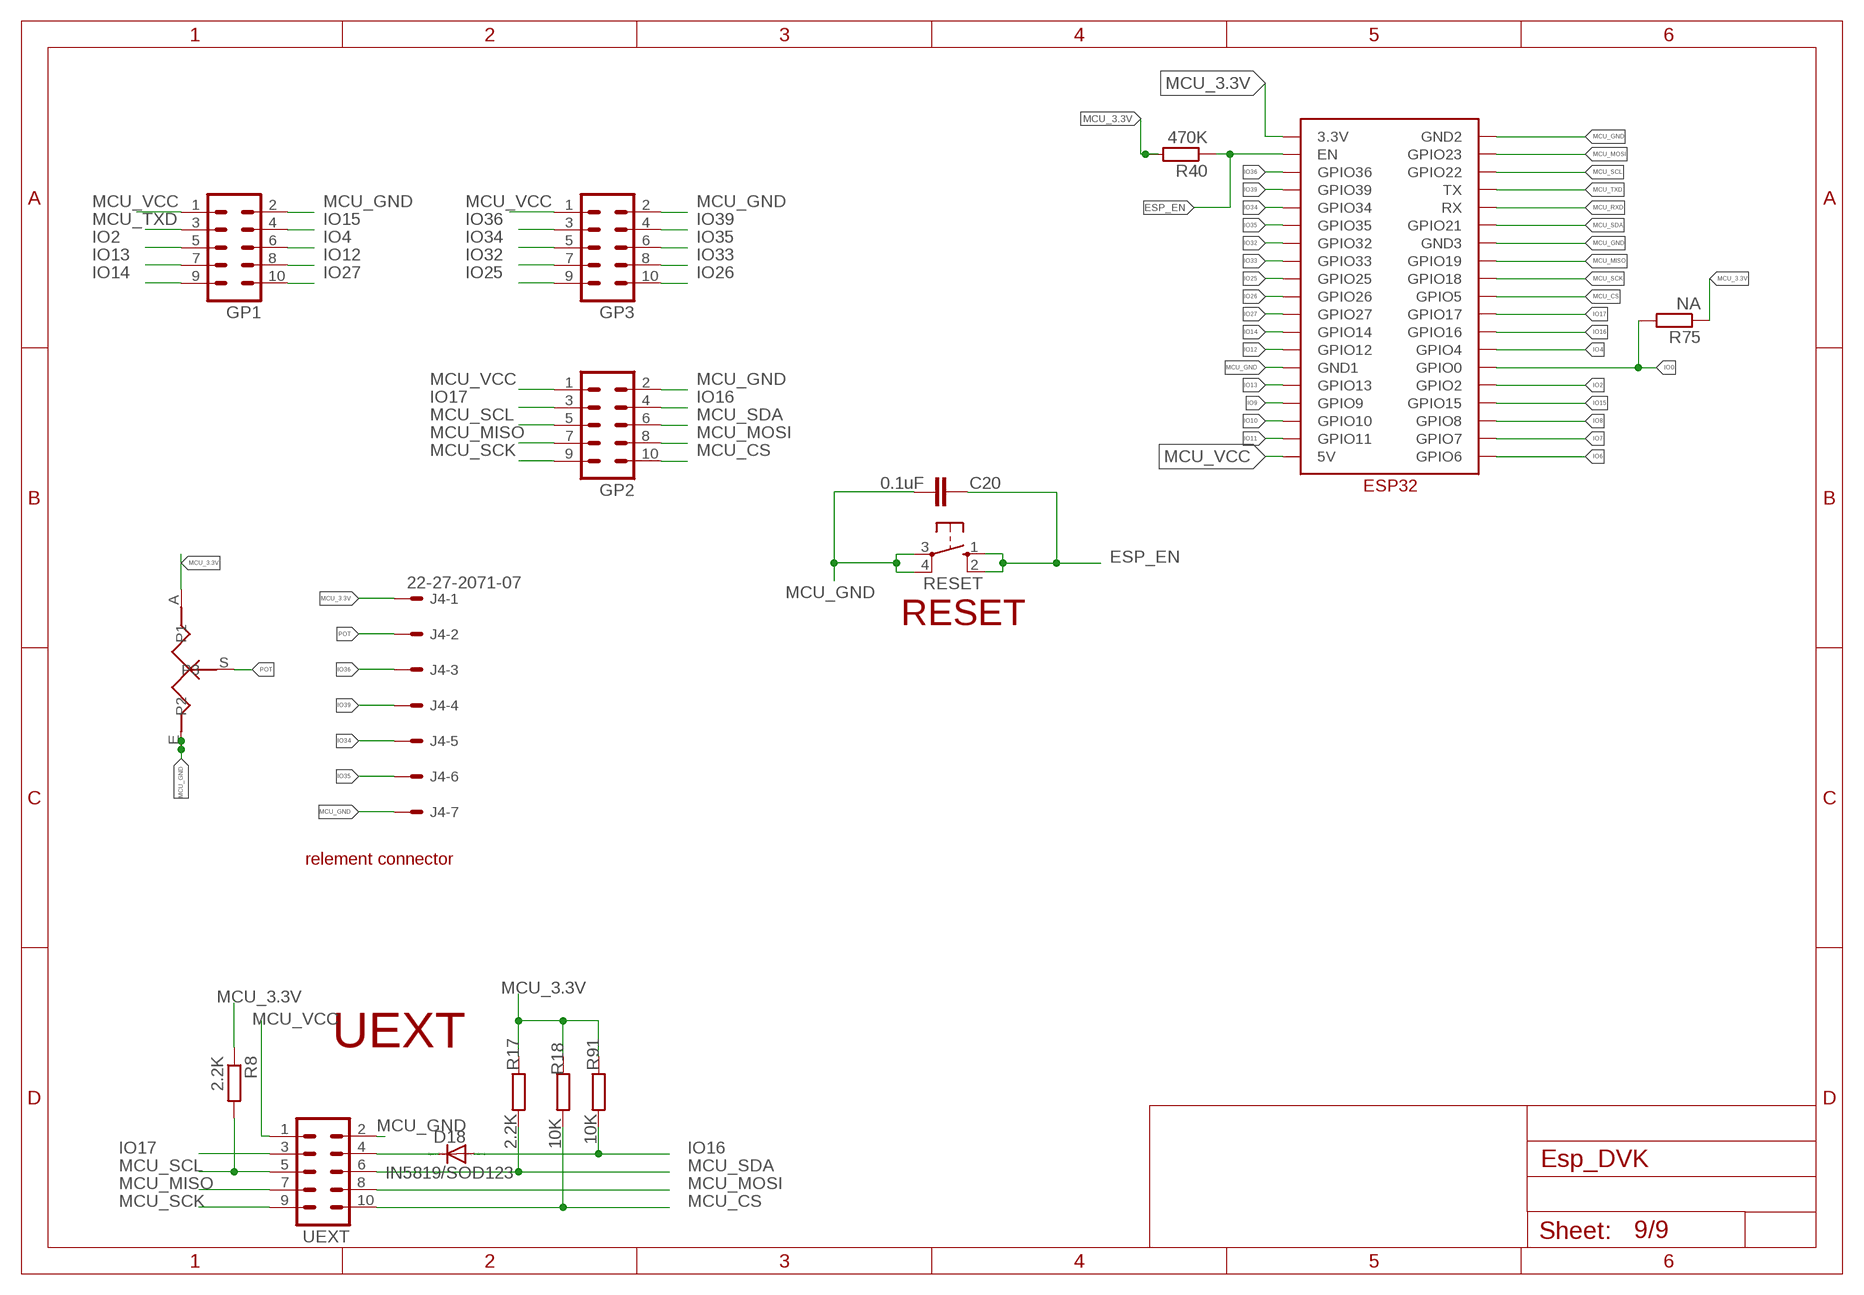
[diagram p8: schematic, sheet 9]

### Parts
C20  0.1uF  C-EUC1206  [C1206]
D18  IN5819/SOD123  DIODE-SOD123  [SOD123]
GP1  ML10  [ML10]
GP2  ML10  [ML10]
GP3  ML10  [ML10]
J4  22-27-2071-07  [6410-07]
POT4  10K  ACP  [CA6V]
R8  2.2K  R-EU_R1206  [R1206]
R17  2.2K  R-EU_R1206  [R1206]
R18  10K  R-EU_R1206  [R1206]
R40  470K  R-EU_R1206  [R1206]
R75  NA  R-EU_R1206  [R1206]
R91  10K  R-EU_R1206  [R1206]
RESET  10-XX  [B3F-10XX]
U$4  ESP32  [ESP32]
UEXT  ML10  [ML10]

### Nets
ESP_EN: C20.1 R40.1 RESET.1(S) RESET.2(S1) U$4.EN
IO0: R75.2 U$4.GPIO0
IO2: GP1.5 U$4.GPIO2
IO4: GP1.6 U$4.GPIO4
IO6: U$4.GPIO6
IO7: U$4.GPIO7
IO8: U$4.GPIO8
IO9: U$4.GPIO9
IO10: U$4.GPIO10
IO11: U$4.GPIO11
IO12: GP1.8 U$4.GPIO12
IO13: GP1.7 U$4.GPIO13
IO14: GP1.9 U$4.GPIO14
IO15: GP1.4 U$4.GPIO15
IO16: D18.A GP2.4 R91.2 U$4.GPIO16
IO17: GP2.3 U$4.GPIO17 UEXT.3
IO25: GP3.9 U$4.GPIO25
IO26: GP3.10 U$4.GPIO26
IO27: GP1.10 U$4.GPIO27
IO32: GP3.7 U$4.GPIO32
IO33: GP3.8 U$4.GPIO33
IO34: GP3.5 J4.5 U$4.GPIO34
IO35: GP3.6 J4.6 U$4.GPIO35
IO36: GP3.3 J4.3 U$4.GPIO36
IO39: GP3.4 J4.4 U$4.GPIO39
MCU_3.3V: J4.1 POT4.A(P1) R8.1 R17.1 R18.1 R40.2 R75.1 R91.1 U$4.3.3V ; also sheet 6
MCU_CS: GP2.10 R18.2 U$4.GPIO5 UEXT.10
MCU_GND: C20.2 GP1.2 GP2.2 GP3.2 J4.7 POT4.E(P2) RESET.3(P) RESET.4(P1) U$4.GND1 U$4.GND2 U$4.GND3 UEXT.2 ; also sheet 6
MCU_MISO: GP2.7 U$4.GPIO19 UEXT.7
MCU_MOSI: GP2.8 U$4.GPIO23 UEXT.8
MCU_RXD: U$4.RX ; also sheet 6
MCU_SCK: GP2.9 U$4.GPIO18 UEXT.9
MCU_SCL: GP2.5 R8.2 U$4.GPIO22 UEXT.5
MCU_SDA: GP2.6 R17.2 U$4.GPIO21 UEXT.6
MCU_TXD: GP1.3 U$4.TX ; also sheet 6
MCU_VCC: GP1.1 GP2.1 GP3.1 U$4.5V UEXT.1 ; also sheet 6
N$70: D18.C UEXT.4
POT: J4.2 POT4.S(P3)

### Notes on the sheet
- RESET
- relement connector
- UEXT

## Power pins joined to a net without a drawn wire
SHELL_GND: J2.S1(SHELL_GND) J2.S2(SHELL_GND) J2.S3(SHELL_GND) J2.S4(SHELL_GND)
SQW/OUT: IC7.7(SQW/OUT)

## Library data of the parts
BATTERY = BATTERY:LEADED
BZ1 = buzzer:BUZZ
C1 C2 C4 C7-C9 C14-C17 C23 C25 C28 C29 C200 C300 = resistor:C-EU: CAPACITOR, European symbol
C3 C5 C6 C10 C12 C13 C20 C22 C24 C33 C34 = rcl:C-EU: CAPACITOR, European symbol
C11 = resistor:CPOL-US: POLARIZED CAPACITOR, American symbol
C21 = capacitorSMD&DIPIDENT:SMD&DIP
D1 = diode:1N5624: DIODE controlled avalanche rectifier
D2-D5 D7-D9 D12 D13 D15 = DIODE SYM:1N4004: DIODE general purpose rectifier, 1 A
D10 = diode:1N4004: DIODE general purpose rectifier, 1 A
D18 = diode:DIODE-: DIODE
D20 D21 = diode:ES2D: DIODE super fast rectifier, 2 A
DACO/P GND = test_pad:TEST_PAD
DIS1 = display-lcd:TUXGR_16X2_R2: Tuxgraphics LCD display 16x2 characters reflective, without background light Source: tuxgr_12x2_r2.pdf; OC_FARNELL: unknown; OC_NEWARK: unknown
DIS2-DIS5 = display-hp:HD-A103: LED DISPLAY 1-character 7 segment, decimal point right; OC_FARNELL: unknown; OC_NEWARK: unknown
EN R/W RS S_1-S_15 = smallslidesw:SMALLSLIDESW
F2 = ptc-littlefuse:1812L
GP1-GP3 UEXT = pooja:ML10: HARTING
H1-H6 H9-H12 = holes:MOUNT-HOLE: MOUNTING HOLE with drill center marker
IC2 = LM2576SMD:LM2596S: STEP-DOWN VOLTAGE REGULATOR
IC3 IC5 IC6 = LM358MX_NOPB:LM358MX_NOPB: Operational Amplifiers - Op Amps LOW PWR DUAL OP AMP Source: Datasheet <http://www.ti.com/lit/ds/symlink/lm358-n.pdf>; ARROW_PART_NUMBER: LM358MX/NOPB; ARROW_PRICE-STOCK: https://www.arrow.com/en/products/lm358mxnopb/texas-instruments; DESCRIPTION: Operational Amplifiers - Op Amps LOW PWR DUAL OP AMP; HEIGHT: 1.75mm; MANUFACTURER_NAME: Texas Instruments; MANUFACTURER_PART_NUMBER: LM358MX/NOPB; MOUSER_PART_NUMBER: 926-LM358MX/NOPB; MOUSER_PRICE-STOCK: https://www.mouser.co.uk/ProductDetail/Texas-Instruments/LM358MX-NOPB?qs=QbsRYf82W3Eh9BTjhMeuoQ%3D%3D
IC4 = microchip:24*: Serial EEPROM I2C; MPN: M24C04-WMN6P; OC_FARNELL: 9882812; OC_NEWARK: 83K1376
IC7 = pooja1:DS1307
IC8 = MCP4921:MCP4921
IC9 = MCP3204:MCP3204
IC10 = linear-technology:LTC485: Low Power RS485 Interface Transceiver Source: http://www.linear.com/pc/downloadDocument.do?navId=H0,C1,C1007,C1017,P2064,D1718; OC_FARNELL: unknown; OC_NEWARK: unknown
IR LD10-LD13 LD_3.3V LD_5V LED1 PHOTO RX TX = led:LED: LED
J1 J3 J5 = FRC:ML10: HARTING
J2 = CSP-USC16-TR:CSP-USC16-TR: Check availability <https://pricing.snapeda.com/parts/CSP-USC16-TR/Valcon/view-part?ref=eda>; AVAILABILITY: In Stock; CHECK_PRICES: https://www.snapeda.com/parts/CSP-USC16-TR/Valcon/view-part/?ref=eda; DESCRIPTION: CSP-USC16-TR Valcon USB Type C Surface Mount PCB Socket; MF: Valcon; MP: CSP-USC16-TR; PACKAGE: None; PRICE: None; PURCHASE-URL: https://www.snapeda.com/api/url_track_click_mouser/?unipart_id=4783629&manufacturer=Valcon&part_name=CSP-USC16-TR&search_term=c type; SNAPEDA_LINK: https://www.snapeda.com/parts/CSP-USC16-TR/Valcon/view-part/?ref=snap
J4 = con-molex:22-?-07: CONNECTOR wire to board 2.54 mm (.1 inch) pitch header; OC_FARNELL: unknown; OC_NEWARK: unknown
J7 J9-J15 J21 J22 = pooja1:ML10: HARTING
K2 K3 = relay:FRS1B: RELAY 1 x switch, same as V23101-D6-A201, Siemens; OC_FARNELL: unknown; OC_NEWARK: unknown
L2 = SMDinductor:DIL4: Dual In Line / Socket
L3 R6 R8 R17 R18 R24 R29 R40 R53-R55 R75 R78-R83 R91 R94-R97 = rcl:R-EU_: RESISTOR, European symbol
L4-L11 = pooja:LED: LED
PJ1 = JACK:JACK
POT1-POT4 = pooja:ACP
Q8 = ipc-7351-transistor:MOSFET-PCH_
R1-R5 R7 R11-R14 R30-R32 R41-R48 R56-R69 R76 R84-R86 = resistor:R-EU_: RESISTOR, European symbol
R9 R10 R15 R16 R20 R25-R28 R33 R37 R38 R74 = resistor:R-US_: RESISTOR, American symbol
R21 = pot:TRIM_EU-: POTENTIOMETER
R22 = pot:TRIM_US-: POTENTIOMETER
R23 R72 R73 = rcl:R-US_: RESISTOR, American symbol
RESET S4 S5 S6. S7-S19 S22-S26 = switch-omron:10-XX: OMRON SWITCH; MPN: B3F-1000; OC_FARNELL: 176432; OC_NEWARK: 36M3542
RGB1 = led_rgb:5MMRGBLED
RL1 RL4 = pooja:S05P: AMP MT CONNECTOR
RL3 = con-amp-mt:S02P: AMP MT CONNECTOR; OC_FARNELL: unknown; OC_NEWARK: unknown
S2 = SW1:SW
T1-T4 = transistor:*-NPN-: NPN Transistror BF959 corrected 2008.03.06
T5 T8 T9 = transistor:*-PNP-: PNP Transistror
U1-U4 U8 U9 U11 = v-reg:LD117A?*: Low drop fixed and adjustable positive voltage regulators 1 A Source: http://www.st.com/stonline/products/literature/ds/7194/ld1117axx.pdf
U5 = L293D:L293D: Dual In Line / Socket
U6 = transistor:BC547: NPN TRANSISTOR
U$3 = CON1.227:FT232
U$4 = ESP32:ESP32
X1 = crystal:CRYSTAL: CRYSTAL; OC_FARNELL: unknown; OC_NEWARK: unknown
X2 X4 = con-ptr500:AK300/3: CONNECTOR; OC_FARNELL: unknown; OC_NEWARK: unknown
X5 = sdcard_TF-07:SDCARD-TF07
X10 = con-ptRr500:AK300/3: CONNECTOR; OC_FARNELL: unknown; OC_NEWARK: unknown

## Net classes
2 gnd: width 0.305 mm, drill 0.559 mm, clearance 0.254 mm